# EAGLE schematic FA_IOTv4.2.1 (EAGLE 7.2.0)

## Sheet 1 of 6
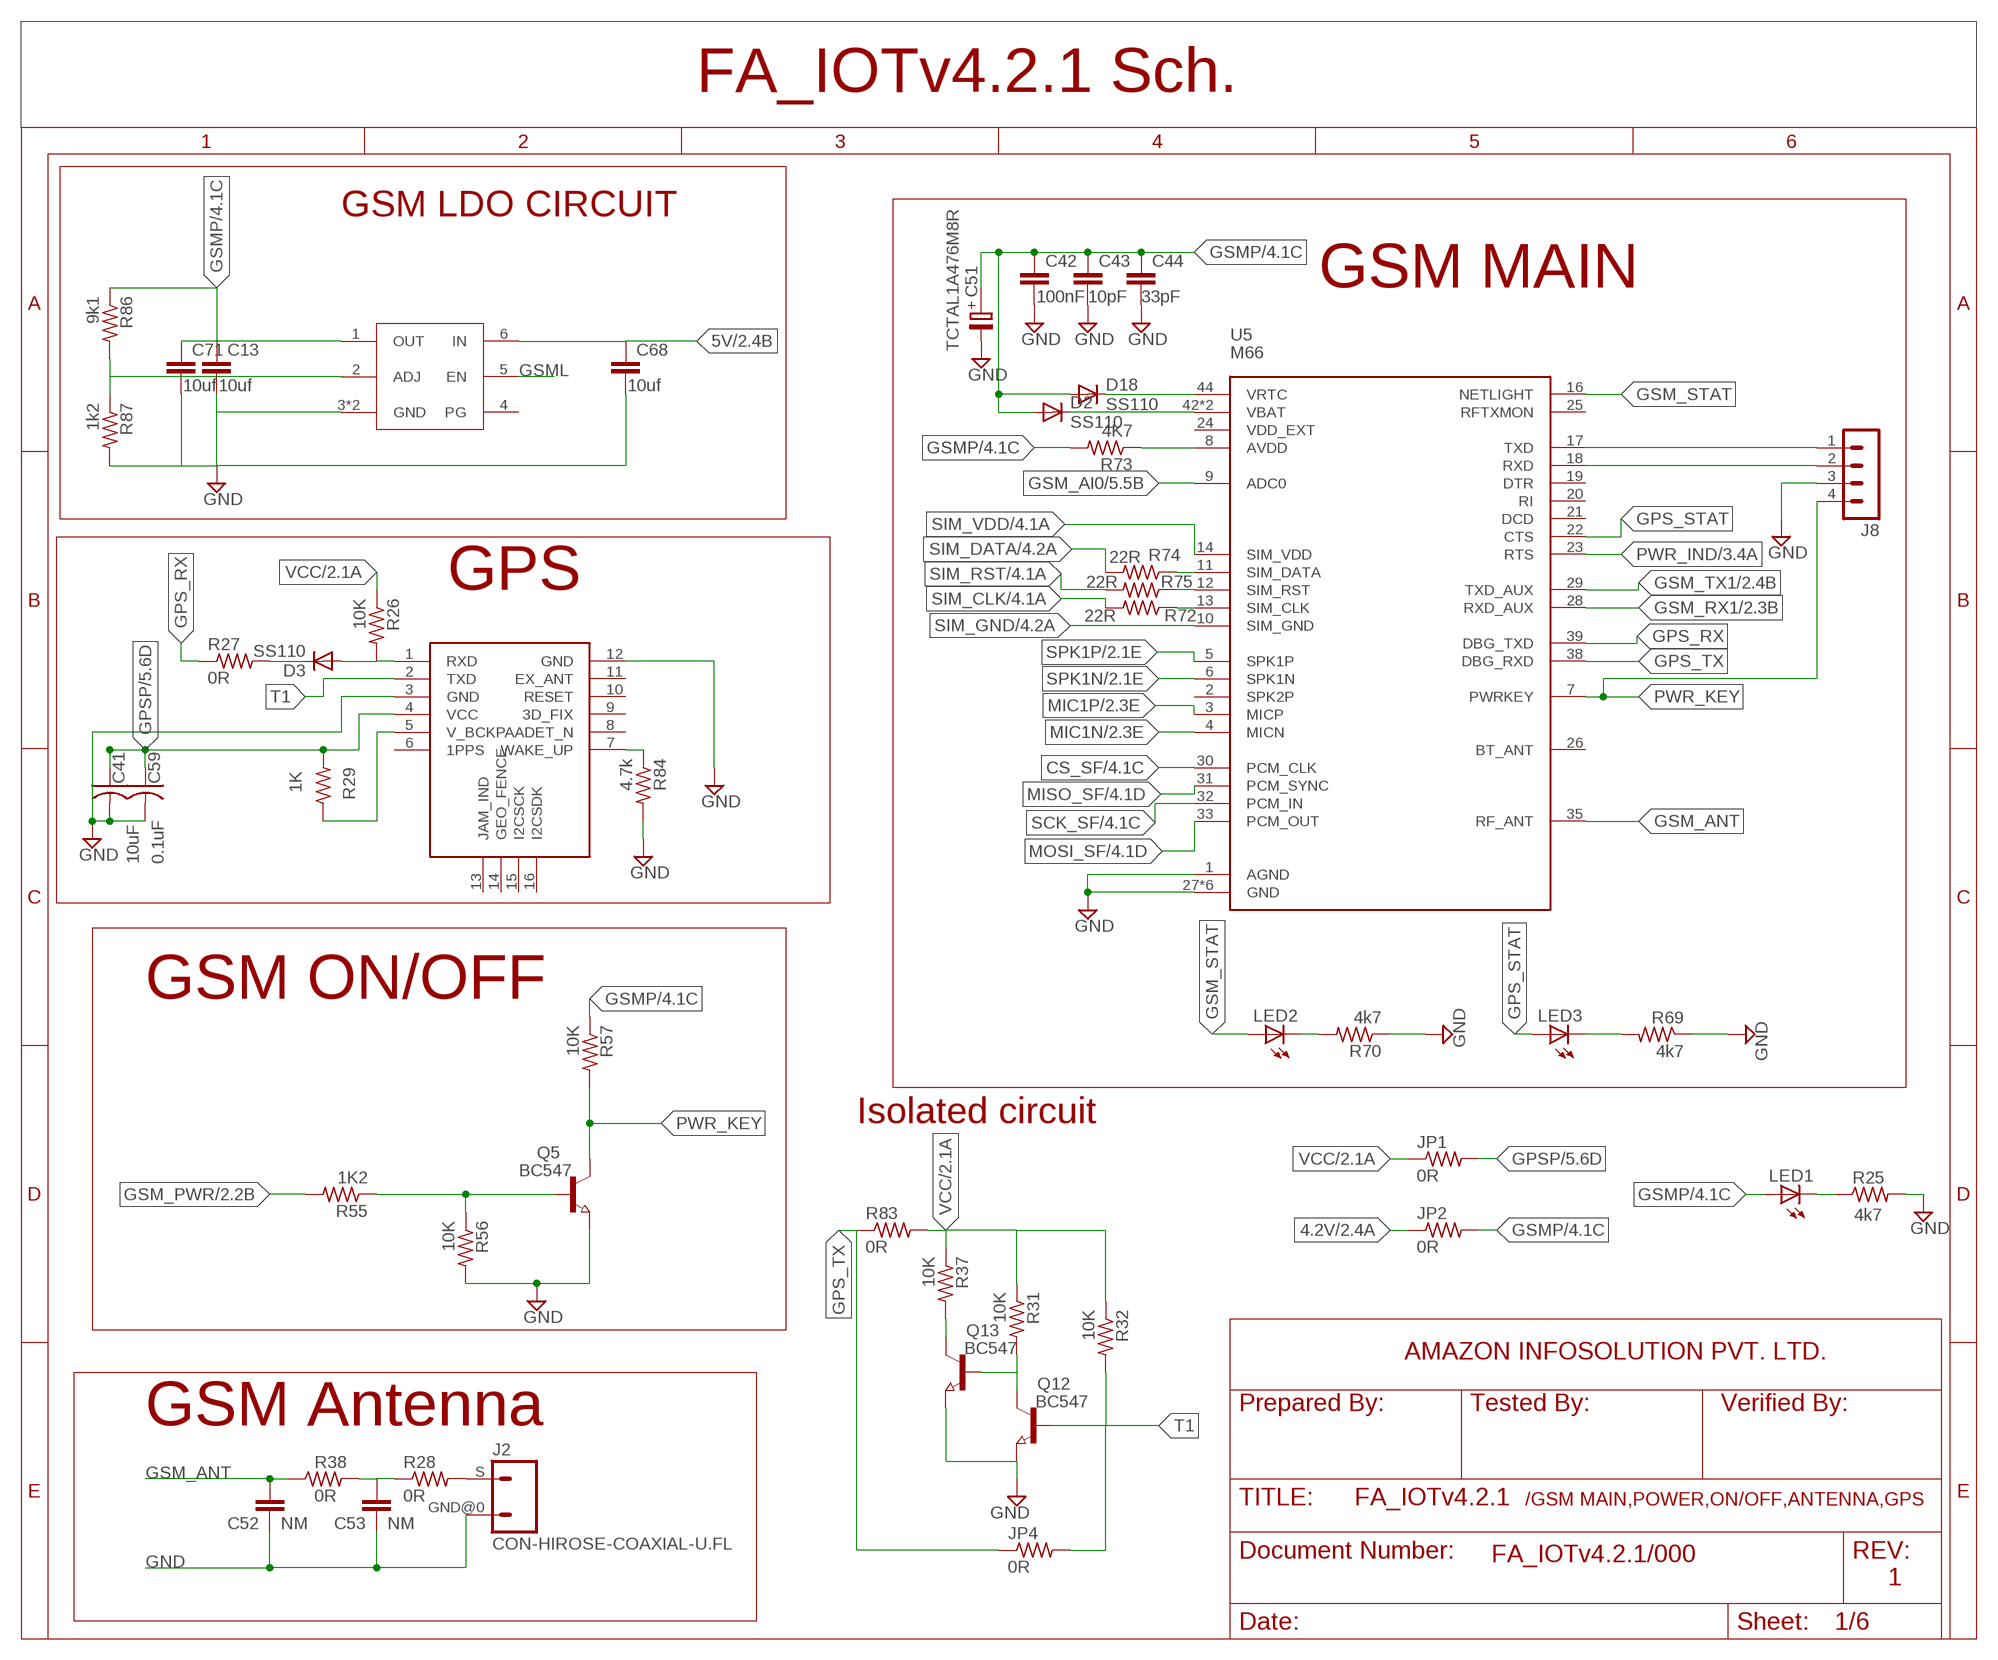
[diagram p0: schematic, sheet 1]

### Parts
C13  10uf  C-EUC0805  [C0805]
C41  10uF  C-USC0805  [C0805]
C42  100nF  C-EUC0805  [C0805]
C43  10pF  C-EUC0805  [C0805]
C44  33pF  C-EUC0805  [C0805]
C51  TCTAL1A476M8R  C-PR-SMD-TE-A  [TE-A-3216]
C52  NM  C-EUC0402  [C0402]
C53  NM  C-EUC0402  [C0402]
C59  0.1uF  C-USC0402  [C0402]
C68  10uf  C-EUC0805  [C0805]
C71  10uf  C-EUC0805  [C0805]
D2  SS110  S1M  [DO-214AC]
D3  SS110  S1M  [DO-214AC]
D18  SS110  S1M  [DO-214AC]
J2  CON-HIROSE-COAXIAL-U.FL  [CON-U.FL]
J8  MA04-1  [MA04-1]
JP1  0R  R-US_R0805  [R0805]
JP2  0R  R-US_R0805  [R0805]
JP4  0R  R-US_R0805  [R0805]
LED1  LEDCHIP-LED0805  [CHIP-LED0805]
LED2  LEDCHIP-LED0805  [CHIP-LED0805]
LED3  LEDCHIP-LED0805  [CHIP-LED0805]
Q5  BC547  NPN-TRANSISTOR_SOT23  [SOT23]
Q12  BC547  NPN-TRANSISTOR_SOT23  [SOT23]
Q13  BC547  NPN-TRANSISTOR_SOT23  [SOT23]
R25  4k7  R-US_R0402  [R0402]
R26  10K  R-US_R0402  [R0402]
R27  0R  R-US_R0805  [R0805]
R28  0R  R-US_R0402  [R0402]
R29  1K  R-US_R0402  [R0402]
R31  10K  R-US_R0402  [R0402]
R32  10K  R-US_R0402  [R0402]
R37  10K  R-US_R0402  [R0402]
R38  0R  R-US_R0402  [R0402]
R55  1K2  R-US_R0402  [R0402]
R56  10K  R-US_R0402  [R0402]
R57  10K  R-US_R0402  [R0402]
R69  4k7  R-US_R0402  [R0402]
R70  4k7  R-US_R0402  [R0402]
R72  22R  R-US_R0402  [R0402]
R73  4K7  R-US_R0402  [R0402]
R74  22R  R-US_R0402  [R0402]
R75  22R  R-US_R0402  [R0402]
R83  0R  R-US_R0805  [R0805]
R84  4.7k  R-US_R0402  [R0402]
R86  9k1  R-US_R0402  [R0402]
R87  1k2  R-US_R0402  [R0402]
U5  M66  [M66]
U$1  L89  [L89]
U$3  LD39200PU33R  [SON95P300X300X100-7N]

### Nets
4.2V [POWER]: JP2.1 ; also sheet 2,3,5
5V: C68.1 U$3.6(IN) ; also sheet 2,4,5,6
CS_SF: U5.30(PCM_CLK) ; also sheet 4
GND: C13.2 C41.2 C42.2 C43.2 C44.2 C51.- C52.2 C53.2 C59.2 C68.2 C71.2 J2.GND@0 J8.3 Q5.2(E) Q12.2(E) Q13.2(E) R25.2 R56.2 R69.1 R70.1 R84.2 R87.2 U5.1(AGND) U5.27(GND) U5.34(GND) U5.36(GND) U5.37(GND) U5.40(GND) U5.41(GND) U$1.3(GND) U$1.12(GND) U$3.3(GND) U$3.7(GND) ; also sheet 2,3,4,5,6
GPS_RX: R27.1 U5.39(DBG_TXD)
GPS_STAT: LED3.A U5.22(CTS)
GPS_TX: JP4.1 R83.1 U5.38(DBG_RXD)
GPSP: C41.1 C59.1 JP1.2 R29.2 U$1.4(VCC) ; also sheet 5
GSM_AI0: U5.9(ADC0) ; also sheet 5
GSM_ANT: C52.1 R38.1 U5.35(RF_ANT)
GSM_PWR: R55.2 ; also sheet 2
GSM_RX1: U5.28(RXD_AUX) ; also sheet 2
GSM_STAT: LED2.A U5.16(NETLIGHT)
GSM_TX1: U5.29(TXD_AUX) ; also sheet 2
GSML: U$3.5(EN) ; also sheet 2
GSMP: C13.1 C42.1 C43.1 C44.1 C51.+ C71.1 D2.A D18.A JP2.2 LED1.A R57.1 R73.2 R86.1 U$3.1(OUT) ; also sheet 4
MIC1N: U5.4(MICN) ; also sheet 2,6
MIC1P: U5.3(MICP) ; also sheet 2,6
MISO_SF: U5.31(PCM_SYNC) ; also sheet 4
MOSI_SF: U5.33(PCM_OUT) ; also sheet 4
N$12: Q13.3(C) R37.2
N$14: D2.C U5.42(VBAT) U5.43(VBAT)
N$18: J2.S R28.2
N$31: R29.1 U$1.5(V_BCKP)
N$32: D3.A R26.2 U$1.1(RXD)
N$36: D3.C R27.2
N$39: Q12.3(C) Q13.1(B) R31.2
N$40: Q5.1(B) R55.1 R56.1
N$46: R84.1 U$1.7(WAKE_UP)
N$52: LED1.C R25.1
N$55: LED3.C R69.2
N$56: LED2.C R70.2
N$57: R73.1 U5.8(AVDD)
N$58: R74.1 U5.11(SIM_DATA)
N$59: D18.C U5.44(VRTC)
N$60: R75.1 U5.12(SIM_RST)
N$61: R72.1 U5.13(SIM_CLK)
N$67: R86.2 R87.1 U$3.2(ADJ)
PWR_IND: U5.23(RTS) ; also sheet 3
PWR_KEY: J8.4 Q5.3(C) R57.2 U5.7(PWRKEY)
RF_ANT: C53.1 R28.1 R38.2
RX_DEBUG: J8.2 U5.18(RXD)
SCK_SF: U5.32(PCM_IN) ; also sheet 4
SIM_CLK: R72.2 ; also sheet 4
SIM_DATA: R74.2 ; also sheet 4
SIM_GND: U5.10(SIM_GND) ; also sheet 4
SIM_RST: R75.2 ; also sheet 4
SIM_VDD: U5.14(SIM_VDD) ; also sheet 4
SPK1N: U5.6(SPK1N) ; also sheet 2,6
SPK1P: U5.5(SPK1P) ; also sheet 2,6
T1: JP4.2 Q12.1(B) R32.2 U$1.2(TXD)
TX_DEBUG: J8.1 U5.17(TXD)
VCC: JP1.1 R26.1 R31.1 R32.1 R37.1 R83.2 ; also sheet 2,3,4,6
Unconnected: U5.2(SPK2P) U5.19(DTR) U5.20(RI) U5.21(DCD) U5.24(VDD_EXT) U5.25(RFTXMON) U5.26(BT_ANT) U$1.6(1PPS) U$1.8(AADET_N) U$1.9(3D_FIX) U$1.10(RESET) U$1.11(EX_ANT) U$1.13(JAM_IND) U$1.14(GEO_FENCE) U$1.15(I2CSCK) U$1.16(I2CSDK) U$3.4(PG)

### Notes on the sheet
- FA_IOTv4.2.1 Sch.
- GSM LDO CIRCUIT
- GSM MAIN
- GPS
- GSM ON/OFF
- Isolated circuit
- AMAZON INFOSOLUTION PVT. LTD.
- Prepared By: | Tested By: | Verified By:
- GSM Antenna
- /GSM MAIN,POWER,ON/OFF,ANTENNA,GPS
- FA_IOTv4.2.1/000
- 1

## Sheet 2 of 6
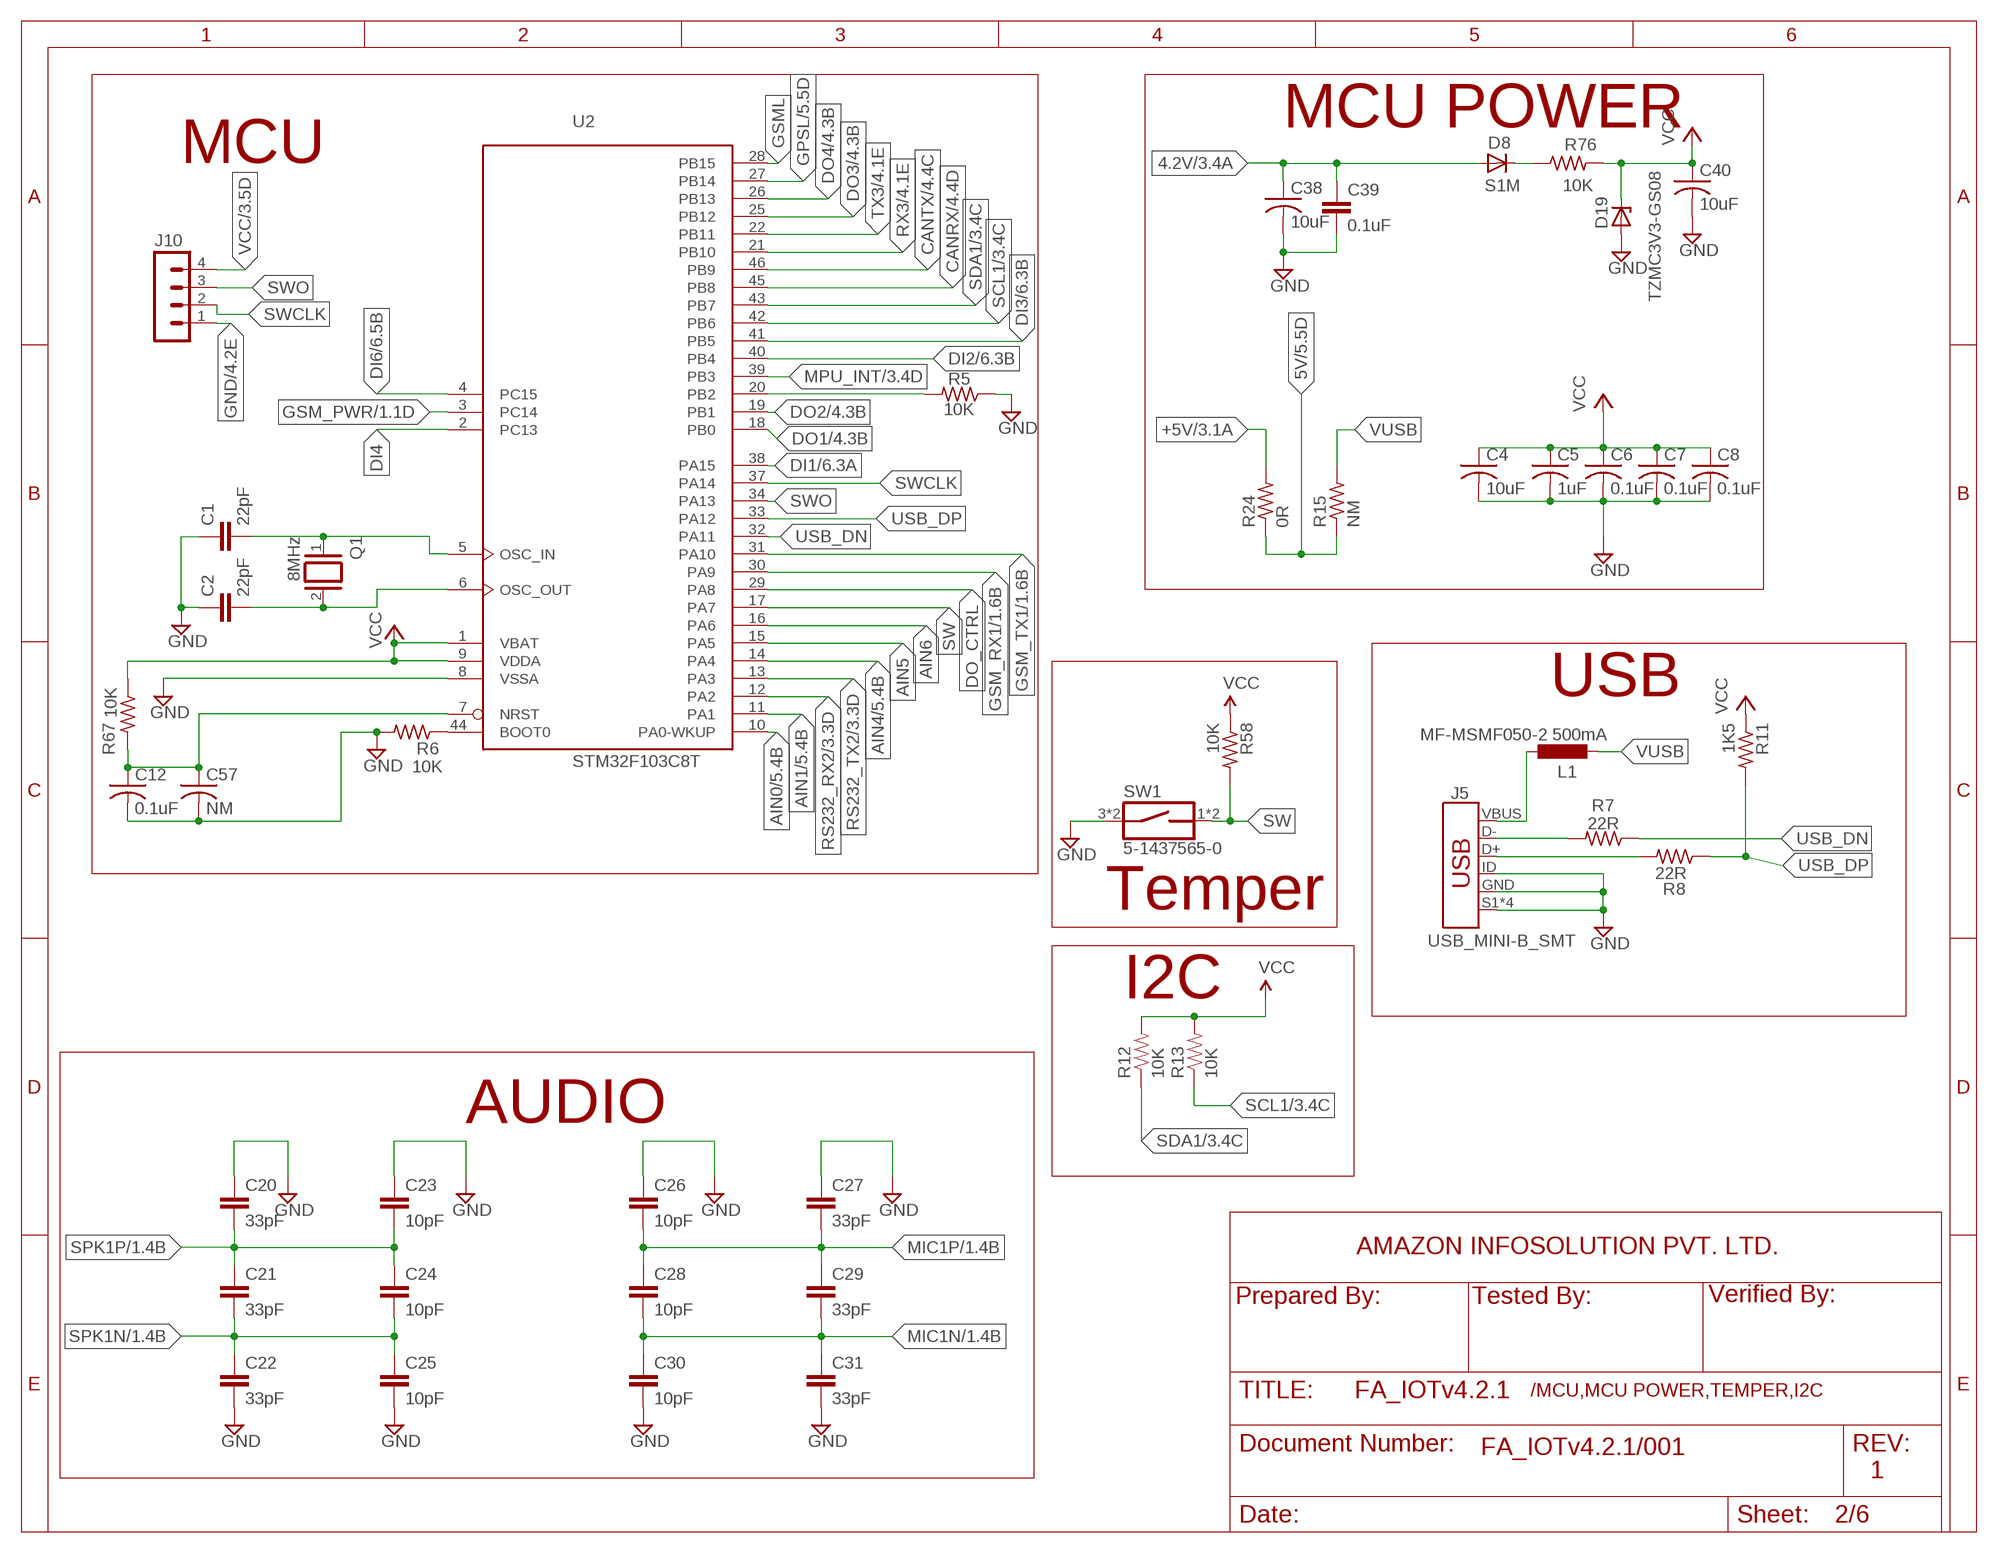
[diagram p1: schematic, sheet 2]

### Parts
C1  22pF  C-EUC0201  [C0201]
C2  22pF  C-EUC0201  [C0201]
C4  10uF  C-USC0805  [C0805]
C5  1uF  C-USC0603  [C0603]
C6  0.1uF  C-USC0402  [C0402]
C7  0.1uF  C-USC0402  [C0402]
C8  0.1uF  C-USC0402  [C0402]
C12  0.1uF  C-USC0402  [C0402]
C20  33pF  C-EUC0402  [C0402]
C21  33pF  C-EUC0402  [C0402]
C22  33pF  C-EUC0402  [C0402]
C23  10pF  C-EUC0402  [C0402]
C24  10pF  C-EUC0402  [C0402]
C25  10pF  C-EUC0402  [C0402]
C26  10pF  C-EUC0402  [C0402]
C27  33pF  C-EUC0402  [C0402]
C28  10pF  C-EUC0402  [C0402]
C29  33pF  C-EUC0402  [C0402]
C30  10pF  C-EUC0402  [C0402]
C31  33pF  C-EUC0402  [C0402]
C38  10uF  C-USC0805  [C0805]
C39  0.1uF  C-EUC0805  [C0805]
C40  10uF  C-USC0805  [C0805]
C57  NM  C-USC0402  [C0402]
D8  S1M  [DO-214AC]
D19  TZMC3V3-GS08  ZENER-DIODESOD80C  [SOD80C]
J5  USB_MINI-B_SMT  [USB-MINIB]
J10  MA04-1  [MA04-1]
L1  MF-MSMF050-2 500mA  L-EUL1812  [L1812]
Q1  8MHz  XTAL/S  [QS]
R5  10K  R-US_R0402  [R0402]
R6  10K  R-US_R0402  [R0402]
R7  22R  R-US_R0402  [R0402]
R8  22R  R-US_R0402  [R0402]
R11  1K5  R-US_R0402  [R0402]
R12  10K  RESISTOR0603-RES  [0603-RES]
R13  10K  RESISTOR0603-RES  [0603-RES]
R15  NM  R-US_R0805  [R0805]
R24  0R  R-US_R0805  [R0805]
R58  10K  R-US_R0402  [R0402]
R67  10K  R-US_R0402  [R0402]
R76  10K  R-US_R0805  [R0805]
SW1  5-1437565-0  [SW_5-1437565-0]
U2  STM32F103C8T  [LQFP48]

### Nets
4.2V [POWER]: C38.1 C39.1 D8.A ; also sheet 1,3,5
5V: R15.1 R24.1 ; also sheet 1,4,5,6
+5V: R24.2 ; also sheet 3
AIN0: U2.10(PA0-WKUP) ; also sheet 5
AIN1: U2.11(PA1) ; also sheet 5
AIN4: U2.14(PA4) ; also sheet 5
AIN5: U2.15(PA5)
AIN6: U2.16(PA6)
CANRX: U2.45(PB8) ; also sheet 4
CANTX: U2.46(PB9) ; also sheet 4
DI1: U2.38(PA15) ; also sheet 6
DI2: U2.40(PB4) ; also sheet 6
DI3: U2.41(PB5) ; also sheet 6
DI4: U2.2(PC13)
DI6: U2.4(PC15) ; also sheet 6
DO1: U2.18(PB0) ; also sheet 4
DO2: U2.19(PB1) ; also sheet 4
DO3: U2.25(PB12) ; also sheet 4
DO4: U2.26(PB13) ; also sheet 4
DO_CTRL: U2.29(PA8)
GND: C1.1 C2.1 C4.2 C5.2 C6.2 C7.2 C8.2 C12.2 C20.1 C22.2 C23.1 C25.2 C26.1 C27.1 C30.2 C31.2 C38.2 C39.2 C40.2 C57.2 D19.A J5.GND J5.ID J5.S1(SHIELD) J5.S2(SHIELD) J5.S3(SHIELD) J5.S4(SHIELD) J10.1 R5.1 R6.2 SW1.3 SW1.4 U2.8(VSSA) ; also sheet 1,3,4,5,6
GPSL: U2.27(PB14) ; also sheet 5
GSM_PWR: U2.3(PC14) ; also sheet 1
GSM_RX1: U2.30(PA9) ; also sheet 1
GSM_TX1: U2.31(PA10) ; also sheet 1
GSML: U2.28(PB15) ; also sheet 1
MIC1N: C28.2 C29.2 C30.1 C31.1 ; also sheet 1,6
MIC1P: C26.2 C27.2 C28.1 C29.1 ; also sheet 1,6
MPU_INT: U2.39(PB3) ; also sheet 3
N$1: C1.2 Q1.1 U2.5(OSC_IN)
N$2: C2.2 Q1.2 U2.6(OSC_OUT)
N$5: R6.1 U2.44(BOOT0)
N$6: R5.2 U2.20(PB2)
N$7: J5.D- R7.2
N$9: J5.D+ R8.2
N$11: J5.VBUS L1.1
N$37: D8.C R76.1
N$38: C12.1 C57.1 R67.2 U2.7(NRST)
RS232_RX2: U2.12(PA2) ; also sheet 3
RS232_TX2: U2.13(PA3) ; also sheet 3
RX3: U2.21(PB10) ; also sheet 4
SCL1: R13.1 U2.42(PB6) ; also sheet 3,6
SDA1: R12.1 U2.43(PB7) ; also sheet 3,6
SPK1N: C21.2 C22.1 C24.2 C25.1 ; also sheet 1,6
SPK1P: C20.2 C21.1 C23.2 C24.1 ; also sheet 1,6
SW: R58.2 SW1.1 SW1.2 U2.17(PA7)
SWCLK: J10.2 U2.37(PA14)
SWO: J10.3 U2.34(PA13)
TX3: U2.22(PB11) ; also sheet 4
USB_DN: R7.1 U2.32(PA11)
USB_DP: R8.1 R11.2 U2.33(PA12)
VCC: C4.1 C5.1 C6.1 C7.1 C8.1 C40.1 D19.C J10.4 R11.1 R12.2 R13.2 R58.1 R67.1 R76.2 U2.1(VBAT) U2.9(VDDA) ; also sheet 1,3,4,6
VUSB: L1.2 R15.2

### Notes on the sheet
- MCU POWER
- MCU
- USB
- Temper
- I2C
- AUDIO
- AMAZON INFOSOLUTION PVT. LTD.
- Prepared By: | Tested By: | Verified By:
- /MCU,MCU POWER,TEMPER,I2C
- FA_IOTv4.2.1/001
- 1

## Sheet 3 of 6
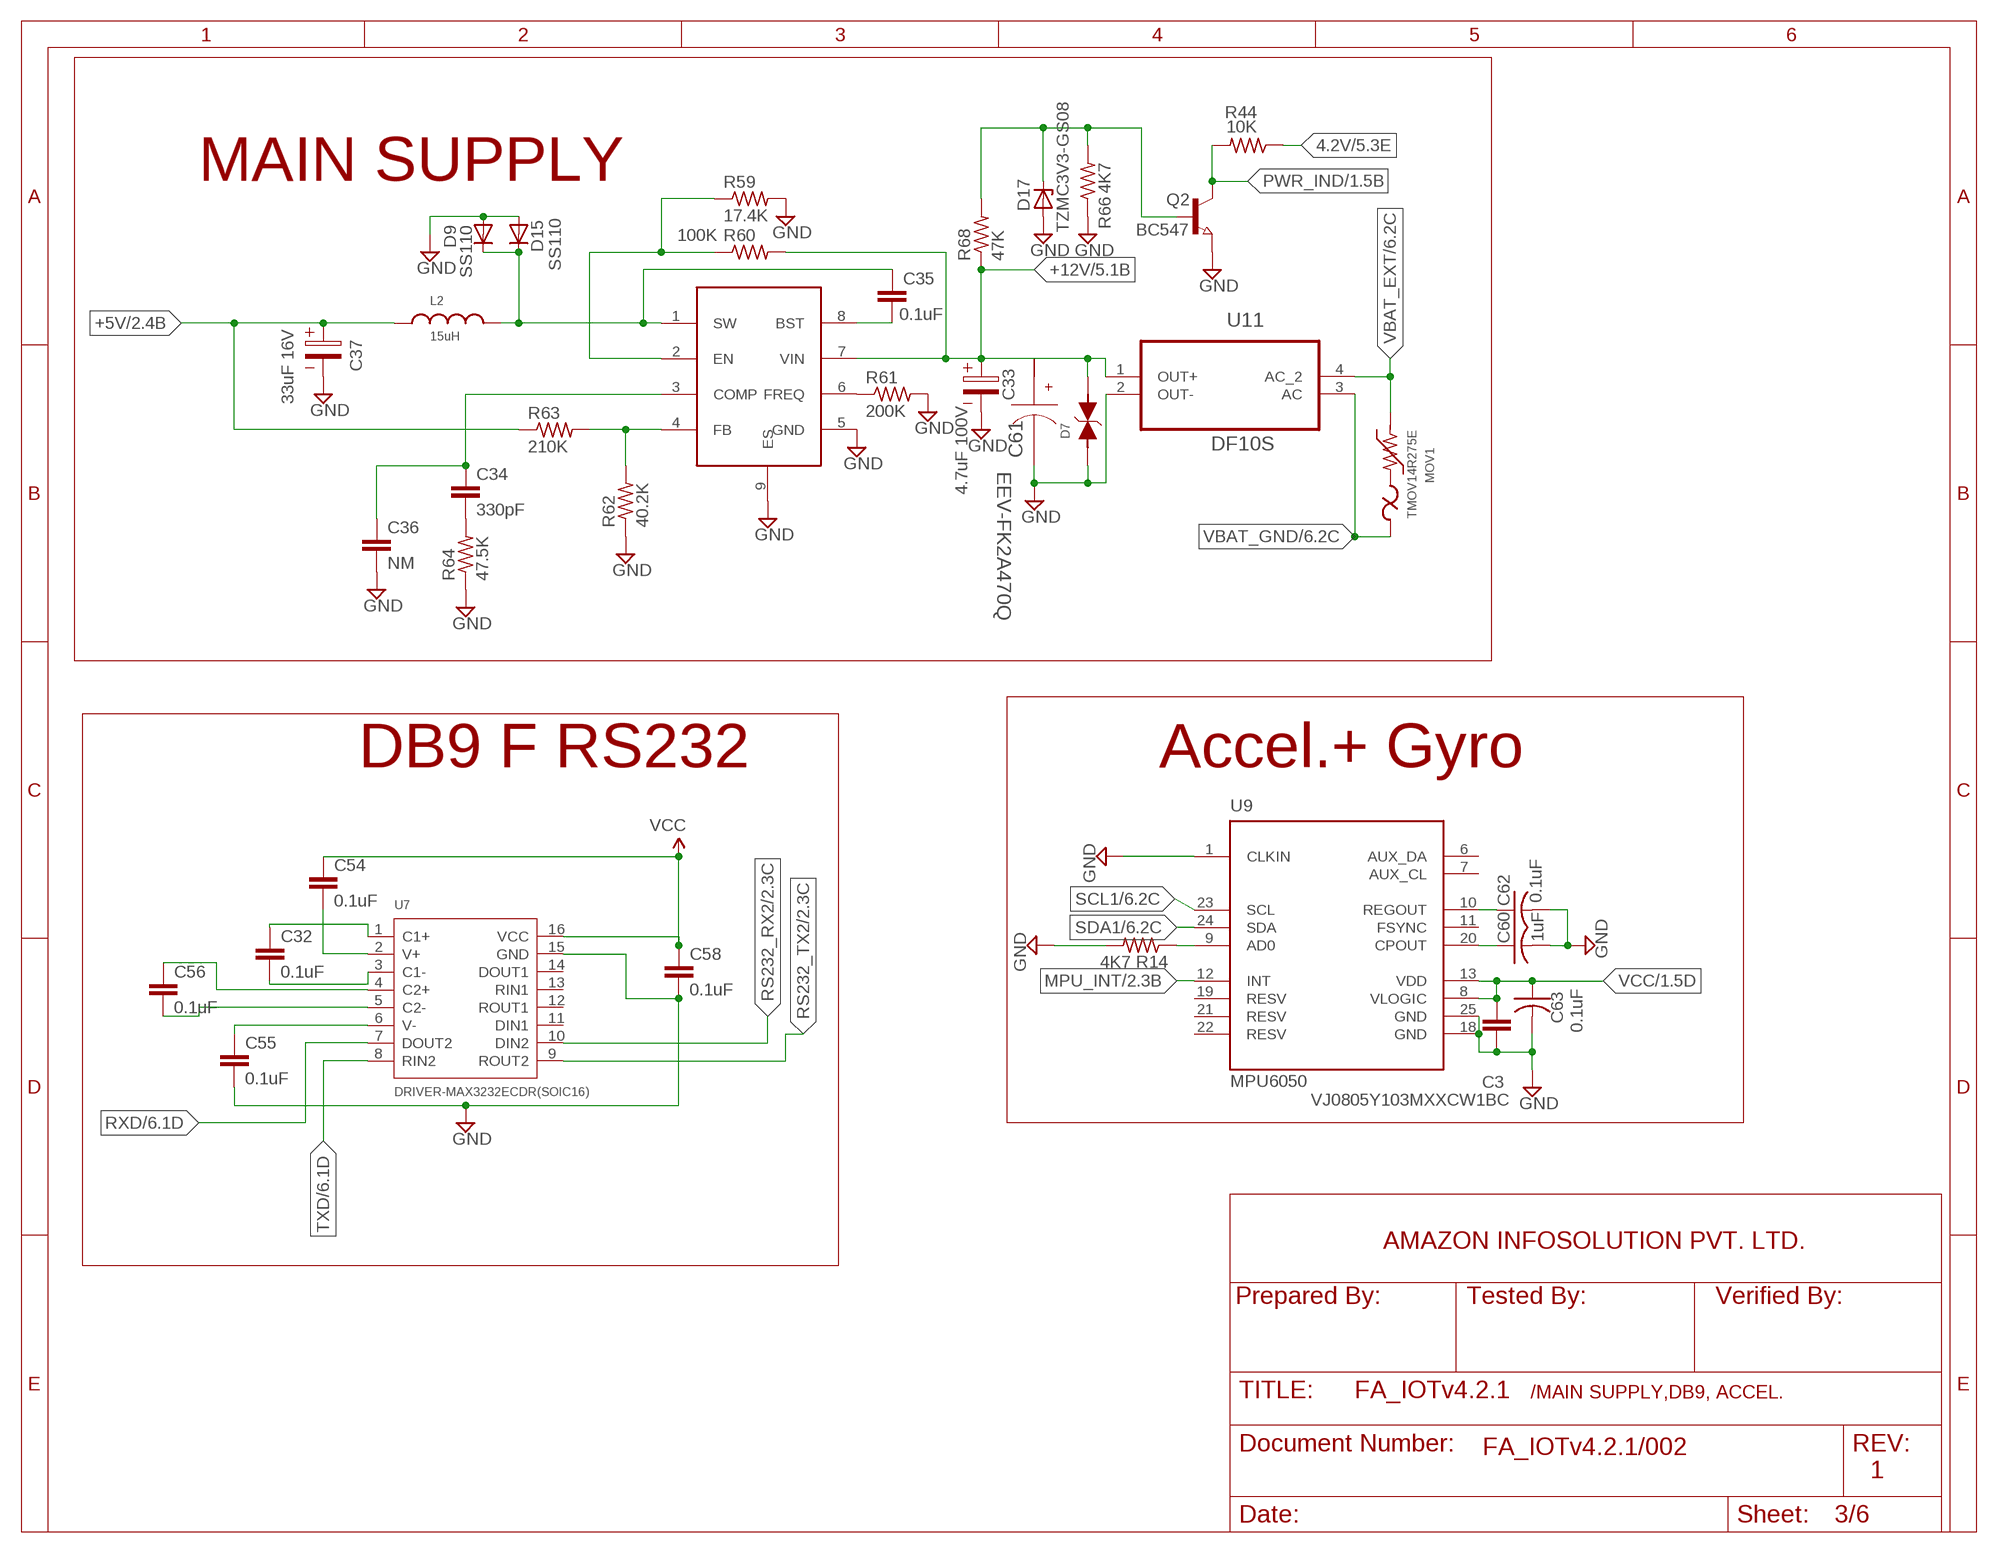
[diagram p2: schematic, sheet 3]

### Parts
C3  VJ0805Y103MXXCW1BC  C-EUC0805  [C0805]
C32  0.1uF  C-EUC0402  [C0402]
C33  4.7uF 100V  WCAP-PSLP_6,3X7,7_875105945001  [3.5X1.6X2.1(BXCXA)]
C34  330pF  C-EUC0805  [C0805]
C35  0.1uF  C-EUC0805  [C0805]
C36  NM  C-EUC0805  [C0805]
C37  33uF 16V  WCAP-ASLI_6,3X5,5_865080343005  [3.5X1.6X2.1(BXCXA)]
C54  0.1uF  C-EUC0402  [C0402]
C55  0.1uF  C-EUC0402  [C0402]
C56  0.1uF  C-EUC0402  [C0402]
C58  0.1uF  C-EUC0402  [C0402]
C60  1uF  C-USC0603  [C0603]
C61  EEV-FK2A470Q  [SM_RADIAL_H13]
C62  0.1uF  C-USC0402  [C0402]
C63  0.1uF  C-USC0402  [C0402]
D7  WE-TVSP_BI_1500W_824541331  [VARTVSP_SMC&SMD/DO-214AB]
D9  SS110  S1M  [DO-214AC]
D15  SS110  S1M  [DO-214AC]
D17  TZMC3V3-GS08  ZENER-DIODESOD80C  [SOD80C]
L2  15uH  WE-PD_1260_744771115  [WE-PD_1260/1245/1280/1210]
MOV1  TMOV14R275E  [TMOV14R275E]
Q2  BC547  NPN-TRANSISTOR_SOT23  [SOT23]
R14  4K7  R-US_R0402  [R0402]
R44  10K  R-US_R0805  [R0805]
R59  17.4K  R-US_R0805  [R0805]
R60  100K  R-US_R0805  [R0805]
R61  200K  R-US_R0805  [R0805]
R62  40.2K  R-US_R0805  [R0805]
R63  210K  R-US_R0805  [R0805]
R64  47.5K  R-US_R0805  [R0805]
R66  4K7  R-US_R0805  [R0805]
R68  47K  R-US_R0805  [R0805]
U7  DRIVER-MAX3232ECDR(SOIC16)  [SOIC16-1.27-10X3.9MM]
U9  MPU6050  [QFN50P400X400X95-25T265X275N]
U10  MP4559DN  [SOIC127P600X170-9N]
U11  DF10S  [SOT508P985X260-4N]

### Nets
4.2V [POWER]: R44.1 ; also sheet 1,2,5
+5V: C37.1 L2.1 R63.1 ; also sheet 2
+12V [POWER]: C33.1 C61.1(+) D7.2 R60.2 R68.1 U10.7(VIN) U11.1(OUT+) ; also sheet 4,5
GND: C3.2 C33.2 C36.2 C37.2 C55.2 C58.2 C60.2 C61.2(-) C62.2 C63.2 D7.1 D9.A D15.A D17.A Q2.2(E) R14.2 R59.2 R61.2 R62.1 R64.1 R66.1 U7.15(GND) U9.1(CLKIN) U9.18(GND) U9.25(GND) U10.5(GND) U10.9(ES) U11.2(OUT-) ; also sheet 1,2,4,5,6
MPU_INT: U9.12(INT) ; also sheet 2
N$17: C35.1 D9.C D15.C L2.2 U10.1(SW)
N$23: R14.1 U9.9(AD0)
N$24: C62.1 U9.10(REGOUT)
N$29: C32.1 U7.1(C1+)
N$30: C32.2 U7.3(C1-)
N$33: C60.1 U9.20(CPOUT)
N$41: R59.1 R60.1 U10.2(EN)
N$42: C34.2 R64.2
N$43: R61.1 U10.6(FREQ)
N$44: R62.2 R63.2 U10.4(FB)
N$49: C34.1 C36.1 U10.3(COMP)
N$51: C35.2 U10.8(BST)
N$62: D17.C Q2.1(B) R66.2 R68.2
N$63: C54.2 U7.2(V+)
N$69: C56.1 U7.4(C2+)
N$70: C56.2 U7.5(C2-)
N$71: C55.1 U7.6(V-)
PWR_IND: Q2.3(C) R44.2 ; also sheet 1
RS232_RX2: U7.10(DIN2) ; also sheet 2
RS232_TX2: U7.9(ROUT2) ; also sheet 2
RXD: U7.7(DOUT2) ; also sheet 6
SCL1: U9.23(SCL) ; also sheet 2,6
SDA1: U9.24(SDA) ; also sheet 2,6
TXD: U7.8(RIN2) ; also sheet 6
VBAT_EXT: MOV1.2(MOV) U11.4(AC_2) ; also sheet 6
VBAT_GND: MOV1.1(FUSE) U11.3(AC) ; also sheet 6
VCC: C3.1 C54.1 C58.1 C63.1 U7.16(VCC) U9.8(VLOGIC) U9.13(VDD) ; also sheet 1,2,4,6
Unconnected: U7.11(DIN1) U7.12(ROUT1) U7.13(RIN1) U7.14(DOUT1) U9.2(NC) U9.3(NC) U9.4(NC) U9.5(NC) U9.6(AUX_DA) U9.7(AUX_CL) U9.11(FSYNC) U9.14(NC) U9.15(NC) U9.16(NC) U9.17(NC) U9.19(RESV) U9.21(RESV) U9.22(RESV)

### Notes on the sheet
- MAIN SUPPLY
- DB9 F RS232 | Accel.+ Gyro
- AMAZON INFOSOLUTION PVT. LTD.
- Prepared By: | Tested By: | Verified By:
- /MAIN SUPPLY,DB9, ACCEL.
- FA_IOTv4.2.1/002
- 1

## Sheet 4 of 6
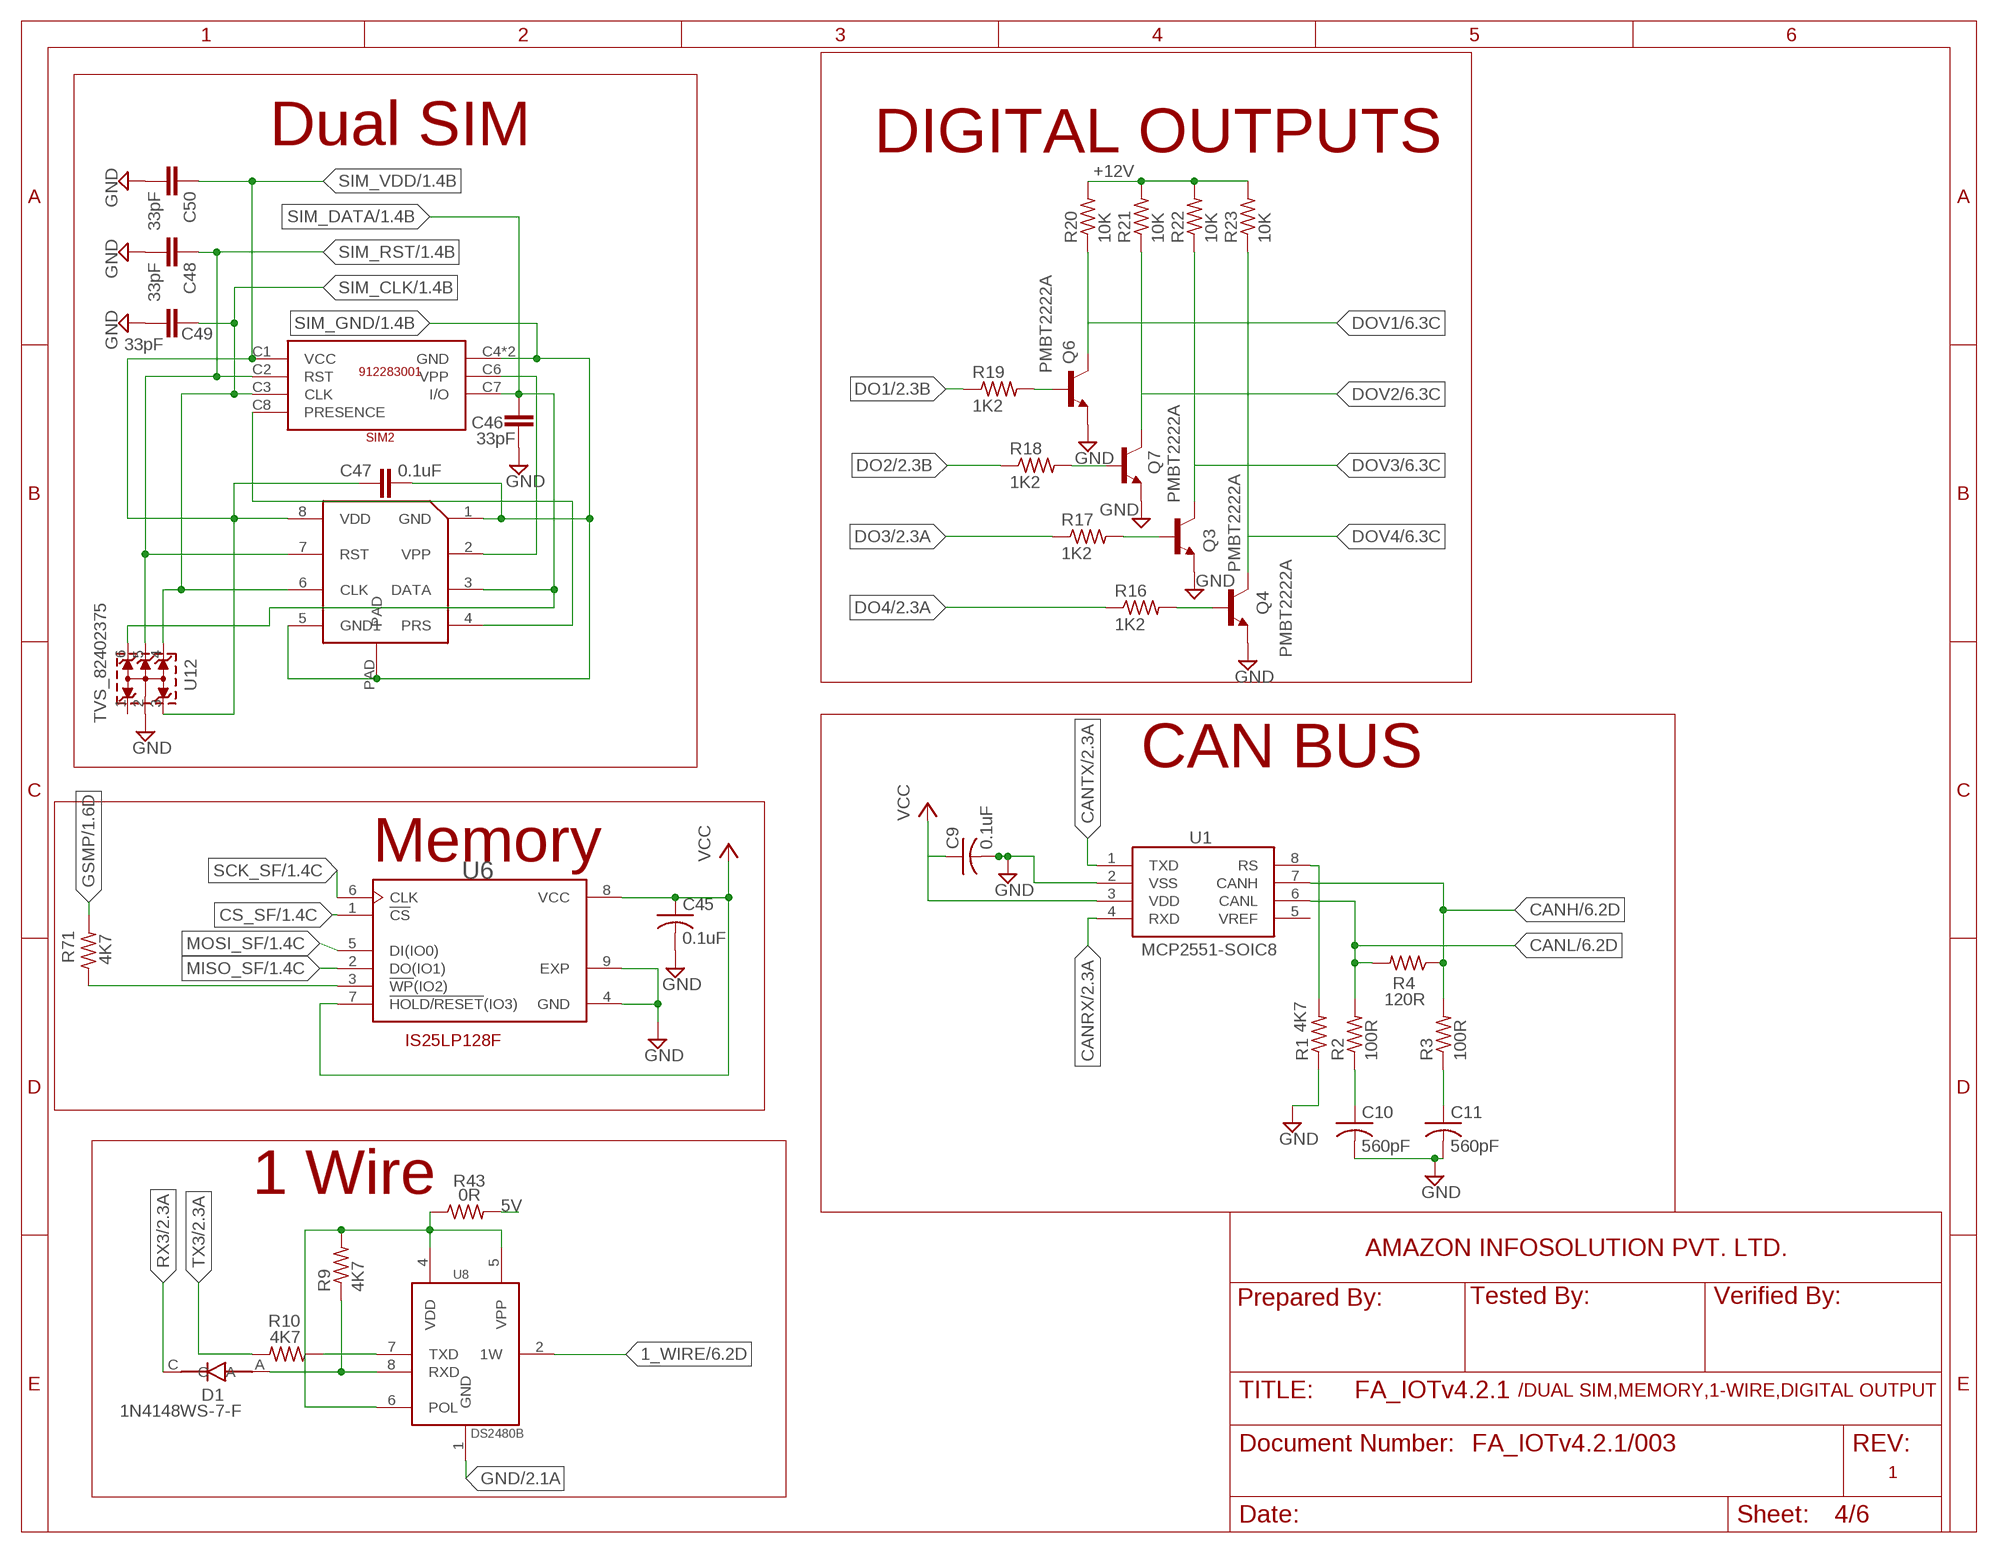
[diagram p3: schematic, sheet 4]

### Parts
C9  0.1uF  C-USC0805  [C0805]
C10  560pF  C-USC0402  [C0402]
C11  560pF  C-USC0402  [C0402]
C45  0.1uF  C-USC0402  [C0402]
C46  33pF  C-EUC0805  [C0805]
C47  0.1uF  C-EUC0805  [C0805]
C48  33pF  C-EUC0805  [C0805]
C49  33pF  C-EUC0805  [C0805]
C50  33pF  C-EUC0805  [C0805]
D1  1N4148WS-7-F  [SOD2513X120N]
Q3  PMBT2222A  [SOT23-BEC]
Q4  PMBT2222A  [SOT23-BEC]
Q6  PMBT2222A  [SOT23-BEC]
Q7  PMBT2222A  [SOT23-BEC]
R1  4K7  R-US_R0402  [R0402]
R2  100R  R-US_R0402  [R0402]
R3  100R  R-US_R0402  [R0402]
R4  120R  R-US_R0402  [R0402]
R9  4K7  R-US_R0402  [R0402]
R10  4K7  R-US_R0402  [R0402]
R16  1K2  R-US_R0402  [R0402]
R17  1K2  R-US_R0402  [R0402]
R18  1K2  R-US_R0402  [R0402]
R19  1K2  R-US_R0402  [R0402]
R20  10K  R-US_R0805  [R0805]
R21  10K  R-US_R0805  [R0805]
R22  10K  R-US_R0805  [R0805]
R23  10K  R-US_R0805  [R0805]
R43  0R  R-US_R0805  [R0805]
R71  4K7  R-US_R0402  [R0402]
SIM1  MFF2_SIM  [MFF2DFN8]
SIM2  912283001  [91228-3001]
U1  MCP2551-SOIC8  [SOIC8-6.0]
U6  W25Q32FVZPIG_TR  [SON127P600X500X80-9N]
U8  DS2480B  [SO08]
U12  TVS_82402375  WE-TVS_82402375  [WE-TVS_SC70-6L]

### Nets
1_WIRE: U8.2(1W) ; also sheet 6
5V: R43.2 ; also sheet 1,2,5,6
+12V [POWER]: R20.2 R21.2 R22.2 R23.2 ; also sheet 3,5
CANH: R3.2 R4.1 U1.7(CANH) ; also sheet 6
CANL: R2.2 R4.2 U1.6(CANL) ; also sheet 6
CANRX: U1.4(RXD) ; also sheet 2
CANTX: U1.1(TXD) ; also sheet 2
CS_SF: U6.1(!CS) ; also sheet 1
DO1: R19.1 ; also sheet 2
DO2: R18.1 ; also sheet 2
DO3: R17.1 ; also sheet 2
DO4: R16.1 ; also sheet 2
DOV1: Q6.C R20.1 ; also sheet 6
DOV2: Q7.C R21.1 ; also sheet 6
DOV3: Q3.C R22.1 ; also sheet 6
DOV4: Q4.C R23.1 ; also sheet 6
GND: C9.2 C10.2 C11.2 C45.2 C46.2 C48.2 C49.2 C50.2 Q3.E Q4.E Q6.E Q7.E R1.1 U1.2(VSS) U6.4(GND) U6.9(EXP) U8.1(GND) U12.2(GND) ; also sheet 1,2,3,5,6
GSMP: R71.2 ; also sheet 1
MISO_SF: U6.2(DO(IO1)) ; also sheet 1
MOSI_SF: U6.5(DI(IO0)) ; also sheet 1
N$3: C10.1 R2.1
N$4: C11.1 R3.1
N$8: R1.2 U1.8(RS)
N$10: R10.1 U8.7(TXD)
N$16: D1.A R9.1 U8.8(RXD)
N$19: Q6.B R19.2
N$20: Q7.B R18.2
N$21: Q3.B R17.2
N$22: Q4.B R16.2
N$34: R9.2 R43.1 U8.4(VDD) U8.5(VPP) U8.6(POL)
N$48: R71.1 U6.3(!WP!(IO2))
N$66: SIM1.4(PRS) SIM2.C8(PRESENCE)
N$68: SIM1.2(VPP) SIM2.C6(VPP)
RX3: D1.C ; also sheet 2
SCK_SF: U6.6(CLK) ; also sheet 1
SIM_CLK: C49.1 SIM1.6(CLK) SIM2.C3(CLK) U12.4 ; also sheet 1
SIM_DATA: C46.1 SIM1.3(DATA) SIM2.C7(I/O) U12.6 ; also sheet 1
SIM_GND: C47.2 SIM1.1(GND) SIM1.5(GND1) SIM1.PAD SIM2.C4(GND) SIM2.C5(GND) ; also sheet 1
SIM_RST: C48.1 SIM1.7(RST) SIM2.C2(RST) U12.5 ; also sheet 1
SIM_VDD: C47.1 C50.1 SIM1.8(VDD) SIM2.C1(VCC) U12.3 ; also sheet 1
TX3: R10.2 ; also sheet 2
VCC: C9.1 C45.1 U1.3(VDD) U6.7(!HOLD/RESET!(IO3)) U6.8(VCC) ; also sheet 1,2,3,6
Unconnected: U1.5(VREF) U12.1

### Notes on the sheet
- Dual SIM | DIGITAL OUTPUTS
- CAN BUS
- Memory
- IS25LP128F
- 1 Wire
- AMAZON INFOSOLUTION PVT. LTD.
- Prepared By: | Tested By: | Verified By:
- /DUAL SIM,MEMORY,1-WIRE,DIGITAL OUTPUT
- FA_IOTv4.2.1/003
- 1

## Sheet 5 of 6
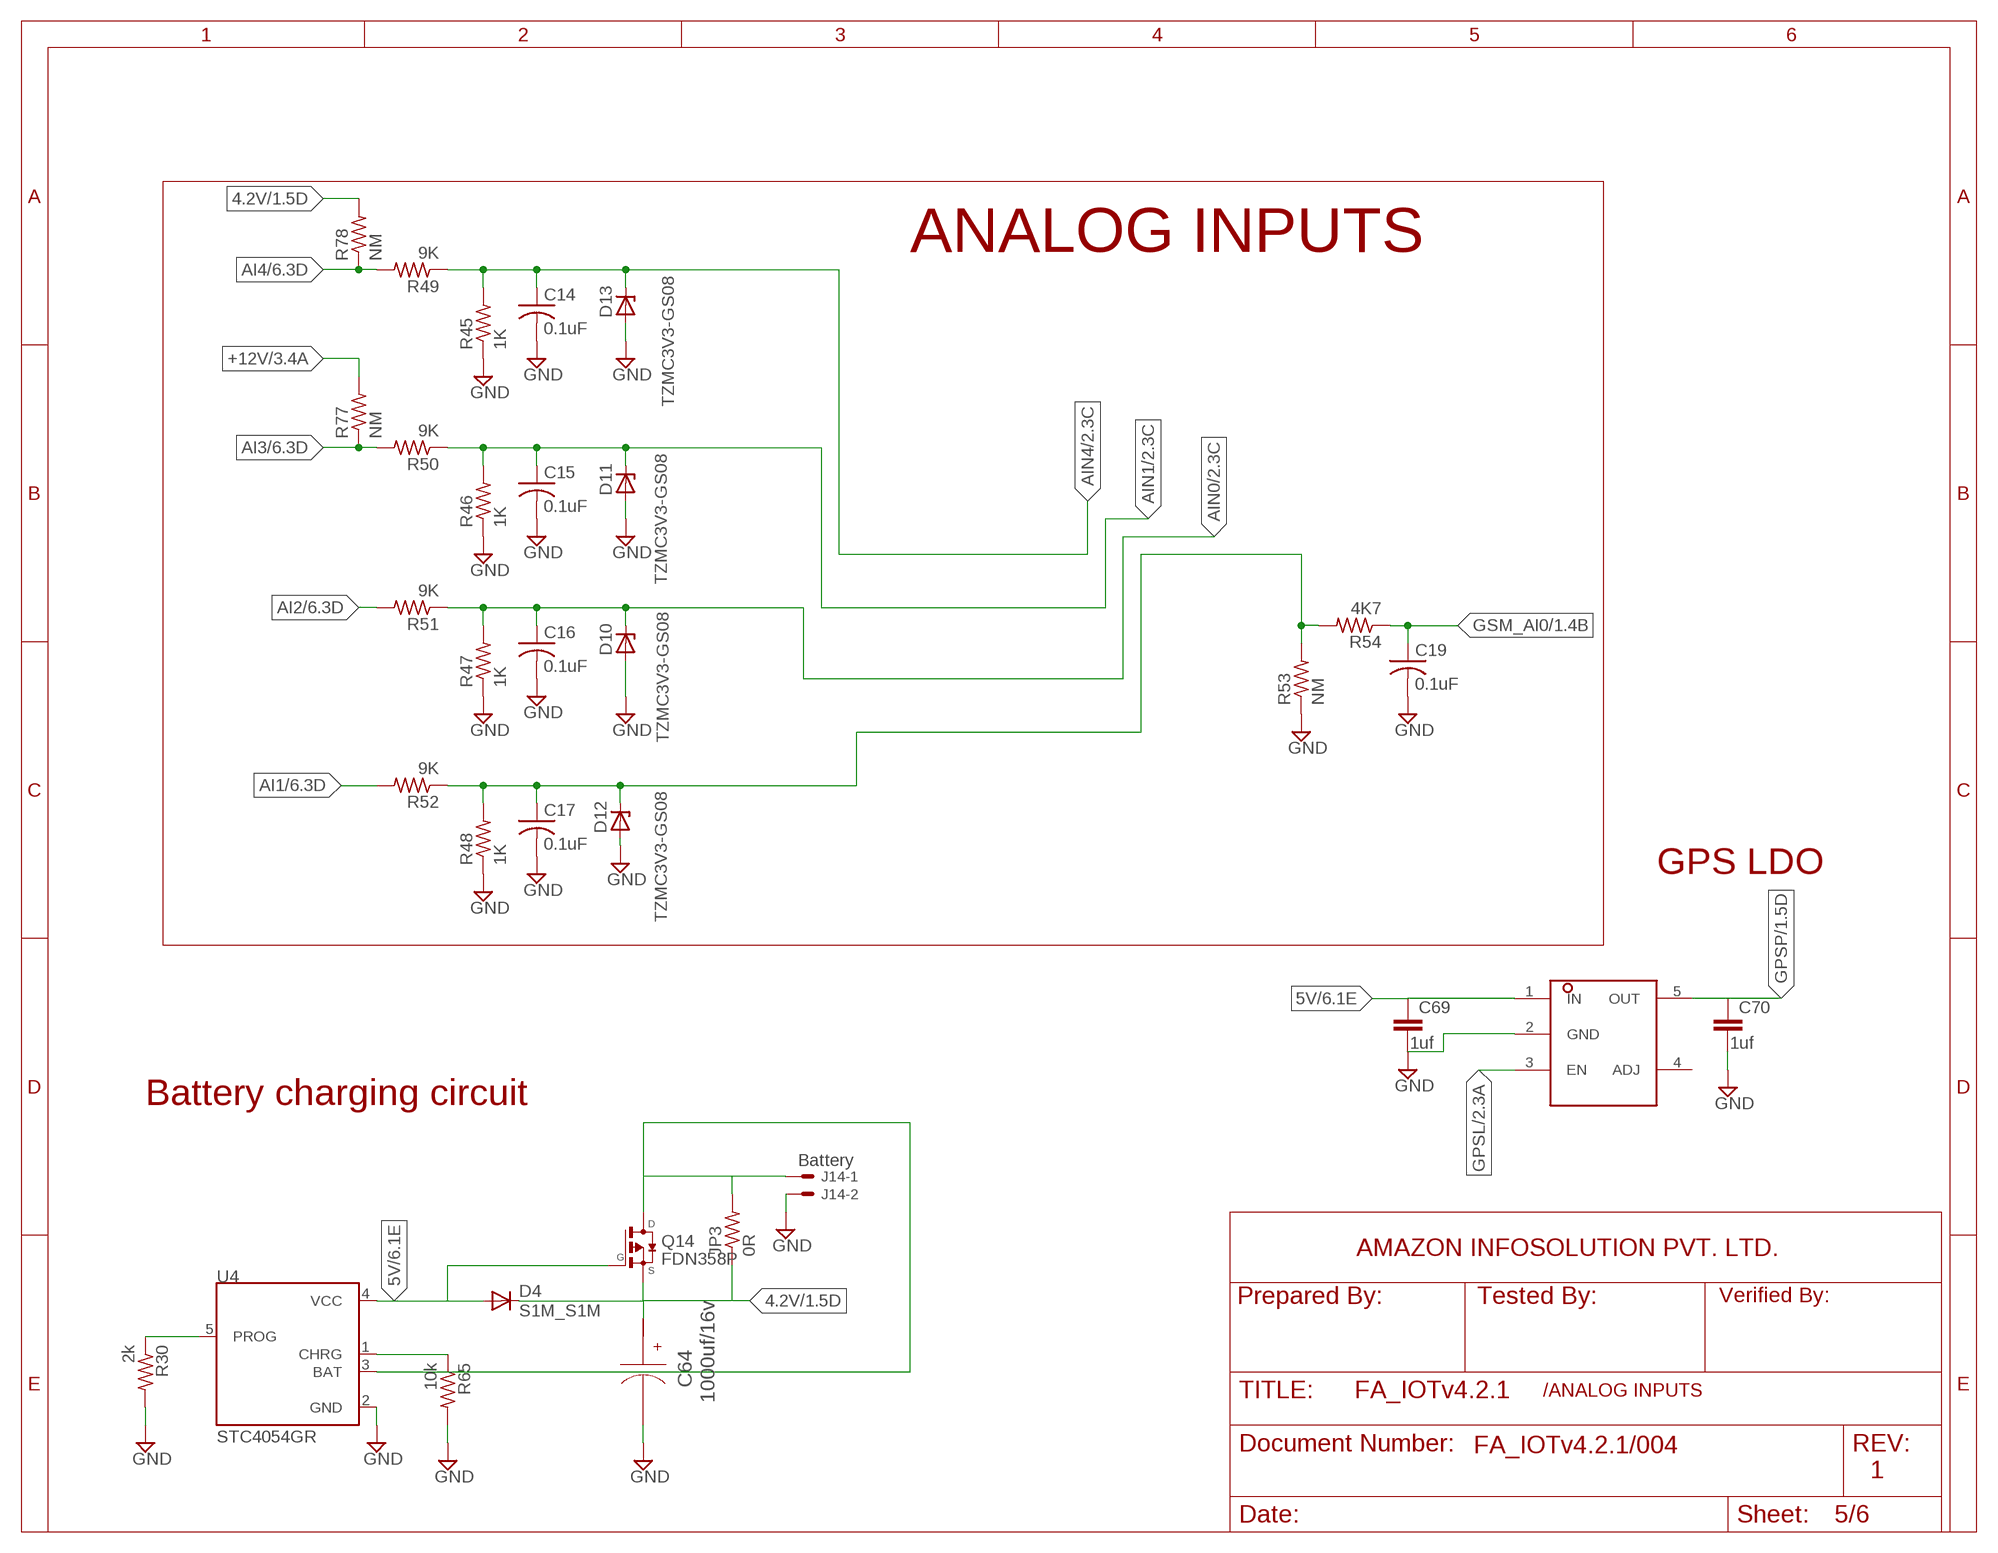
[diagram p4: schematic, sheet 5]

### Parts
C14  0.1uF  C-USC0402  [C0402]
C15  0.1uF  C-USC0402  [C0402]
C16  0.1uF  C-USC0402  [C0402]
C17  0.1uF  C-USC0402  [C0402]
C19  0.1uF  C-USC0402  [C0402]
C64  1000uf/16v  EEV-FK2A470Q  [SM_RADIAL_H13]
C69  1uf  C-EUC0603  [C0603]
C70  1uf  C-EUC0603  [C0603]
D4  S1M_S1M  [S1M_DO-214AC]
D10  TZMC3V3-GS08  ZENER-DIODESOD80C  [SOD80C]
D11  TZMC3V3-GS08  ZENER-DIODESOD80C  [SOD80C]
D12  TZMC3V3-GS08  ZENER-DIODESOD80C  [SOD80C]
D13  TZMC3V3-GS08  ZENER-DIODESOD80C  [SOD80C]
J14  Battery  22-27-2021-02  [6410-02]
JP3  0R  R-US_R0805  [R0805]
Q14  FDN358P  [SSOT-3]
R30  2k  R-US_R0402  [R0402]
R45  1K  R-US_R0402  [R0402]
R46  1K  R-US_R0402  [R0402]
R47  1K  R-US_R0402  [R0402]
R48  1K  R-US_R0402  [R0402]
R49  9K  R-US_R0402  [R0402]
R50  9K  R-US_R0402  [R0402]
R51  9K  R-US_R0402  [R0402]
R52  9K  R-US_R0402  [R0402]
R53  NM  R-US_R0402  [R0402]
R54  4K7  R-US_R0402  [R0402]
R65  10k  R-US_R0402  [R0402]
R77  NM  R-US_R0805  [R0805]
R78  NM  R-US_R0805  [R0805]
U4  STC4054GR  [SOT95P280X110-5N]
U$4  LDK220M33R  [SOT95P280X145-5N]

### Nets
4.2V [POWER]: C64.1(+) D4.C JP3.1 Q14.2(S) R78.2 ; also sheet 1,2,3
5V: C69.1 D4.A Q14.1(G) U4.4(VCC) U$4.1(IN) ; also sheet 1,2,4,6
+12V [POWER]: R77.2 ; also sheet 3,4
AI1: R52.2 ; also sheet 6
AI2: R51.2 ; also sheet 6
AI3: R50.2 R77.1 ; also sheet 6
AI4: R49.2 R78.1 ; also sheet 6
AIN0: C16.1 D10.C R47.2 R51.1 ; also sheet 2
AIN1: C15.1 D11.C R46.2 R50.1 ; also sheet 2
AIN4: C14.1 D13.C R45.2 R49.1 ; also sheet 2
FB4: C17.1 D12.C R48.2 R52.1 R53.2 R54.2
GND: C14.2 C15.2 C16.2 C17.2 C19.2 C64.2(-) C69.2 C70.2 D10.A D11.A D12.A D13.A J14.2 R30.2 R45.1 R46.1 R47.1 R48.1 R53.1 R65.2 U4.2(GND) U$4.2(GND) ; also sheet 1,2,3,4,6
GPSL: U$4.3(EN) ; also sheet 2
GPSP: C70.1 U$4.5(OUT) ; also sheet 1
GSM_AI0: C19.1 R54.1 ; also sheet 1
N$15: J14.1 JP3.2 Q14.3(D) U4.3(BAT)
N$35: R65.1 U4.1(CHRG)
N$45: R30.1 U4.5(PROG)
Unconnected: U$4.4(ADJ)

### Notes on the sheet
- ANALOG INPUTS
- GPS LDO
- Battery charging circuit
- AMAZON INFOSOLUTION PVT. LTD.
- Prepared By: | Tested By: | Verified By:
- /ANALOG INPUTS
- FA_IOTv4.2.1/004
- 1

## Sheet 6 of 6
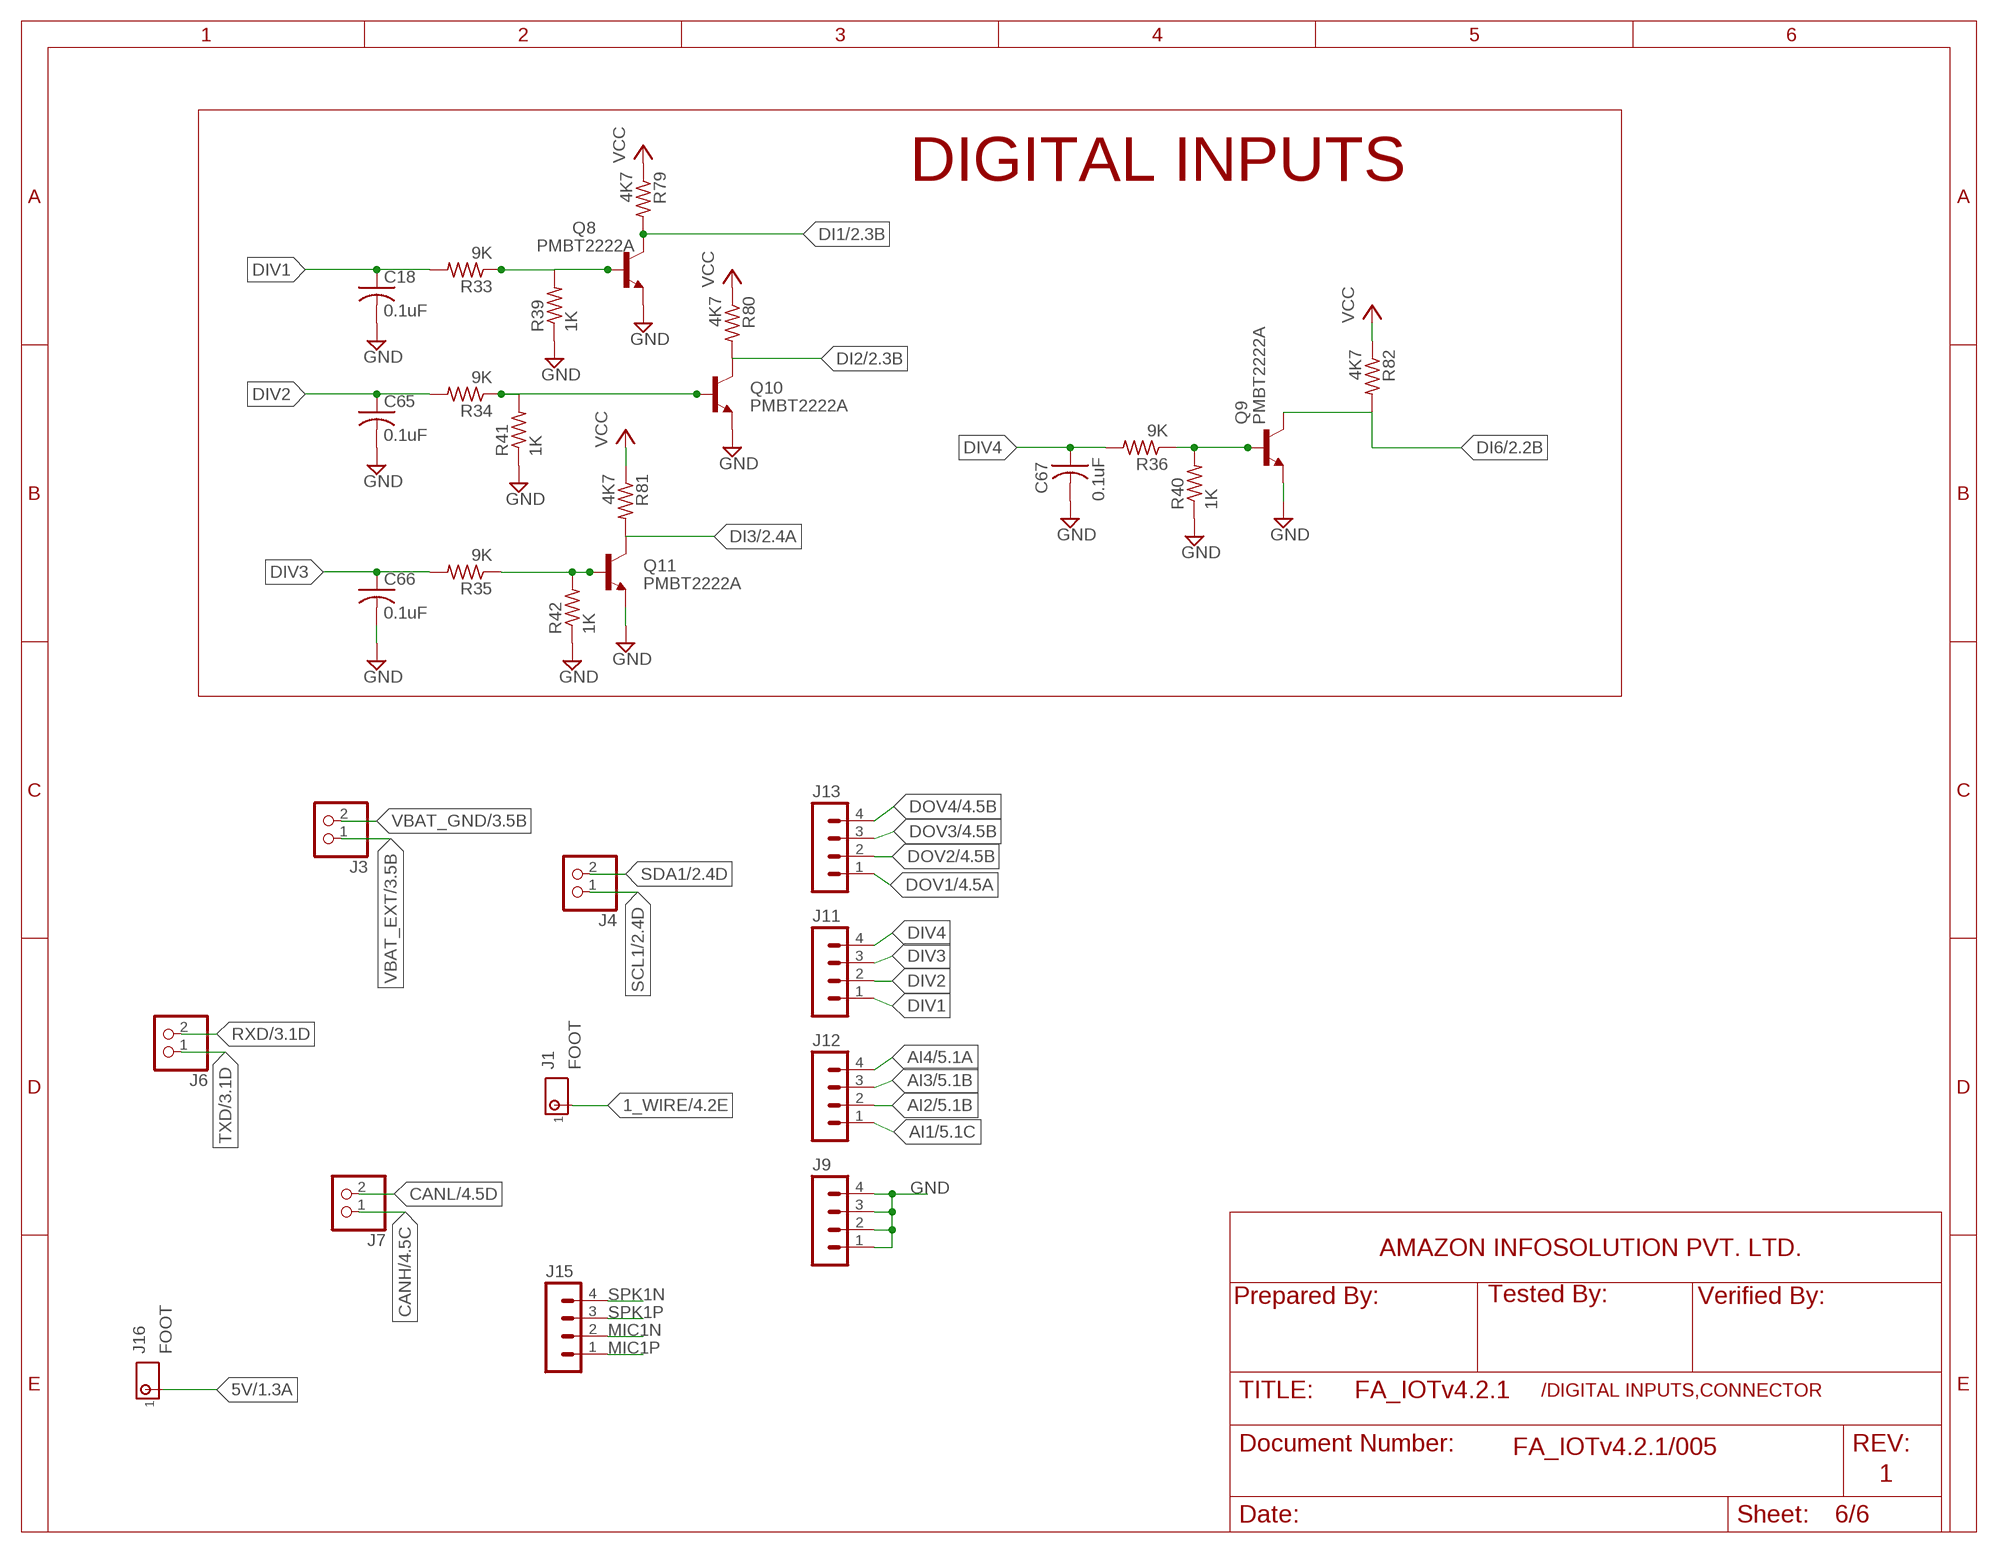
[diagram p5: schematic, sheet 6]

### Parts
C18  0.1uF  C-USC0402  [C0402]
C65  0.1uF  C-USC0402  [C0402]
C66  0.1uF  C-USC0402  [C0402]
C67  0.1uF  C-USC0402  [C0402]
J1  FOOT  [FOOT]
J3  PINHD-1X2  [1X02]
J4  PINHD-1X2  [1X02]
J6  PINHD-1X2  [1X02]
J7  PINHD-1X2  [1X02]
J9  MA04-1  [MA04-1]
J11  MA04-1  [MA04-1]
J12  MA04-1  [MA04-1]
J13  MA04-1  [MA04-1]
J15  MA04-1  [MA04-1]
J16  FOOT  [FOOT]
Q8  PMBT2222A  [SOT23-BEC]
Q9  PMBT2222A  [SOT23-BEC]
Q10  PMBT2222A  [SOT23-BEC]
Q11  PMBT2222A  [SOT23-BEC]
R33  9K  R-US_R0402  [R0402]
R34  9K  R-US_R0402  [R0402]
R35  9K  R-US_R0402  [R0402]
R36  9K  R-US_R0402  [R0402]
R39  1K  R-US_R0402  [R0402]
R40  1K  R-US_R0402  [R0402]
R41  1K  R-US_R0402  [R0402]
R42  1K  R-US_R0402  [R0402]
R79  4K7  R-US_R0402  [R0402]
R80  4K7  R-US_R0402  [R0402]
R81  4K7  R-US_R0402  [R0402]
R82  4K7  R-US_R0402  [R0402]

### Nets
1_WIRE: J1.1 ; also sheet 4
5V: J16.1 ; also sheet 1,2,4,5
AI1: J12.1 ; also sheet 5
AI2: J12.2 ; also sheet 5
AI3: J12.3 ; also sheet 5
AI4: J12.4 ; also sheet 5
CANH: J7.1 ; also sheet 4
CANL: J7.2 ; also sheet 4
DI1: Q8.C R79.2 ; also sheet 2
DI2: Q10.C R80.2 ; also sheet 2
DI3: Q11.C R81.2 ; also sheet 2
DI6: Q9.C R82.2 ; also sheet 2
DIV1: C18.1 J11.1 R33.2
DIV2: C65.1 J11.2 R34.2
DIV3: C66.1 J11.3 R35.2
DIV4: C67.1 J11.4 R36.2
DOV1: J13.1 ; also sheet 4
DOV2: J13.2 ; also sheet 4
DOV3: J13.3 ; also sheet 4
DOV4: J13.4 ; also sheet 4
GND: C18.2 C65.2 C66.2 C67.2 J9.1 J9.2 J9.3 J9.4 Q8.E Q9.E Q10.E Q11.E R39.1 R40.1 R41.1 R42.1 ; also sheet 1,2,3,4,5
MIC1N: J15.2 ; also sheet 1,2
MIC1P: J15.1 ; also sheet 1,2
N$25: Q8.B R33.1 R39.2
N$26: Q9.B R36.1 R40.2
N$27: Q10.B R34.1 R41.2
N$28: Q11.B R35.1 R42.2
RXD: J6.2 ; also sheet 3
SCL1: J4.1 ; also sheet 2,3
SDA1: J4.2 ; also sheet 2,3
SPK1N: J15.4 ; also sheet 1,2
SPK1P: J15.3 ; also sheet 1,2
TXD: J6.1 ; also sheet 3
VBAT_EXT: J3.1 ; also sheet 3
VBAT_GND: J3.2 ; also sheet 3
VCC: R79.1 R80.1 R81.1 R82.1 ; also sheet 1,2,3,4

### Notes on the sheet
- DIGITAL INPUTS
- AMAZON INFOSOLUTION PVT. LTD.
- Prepared By: | Tested By: | Verified By:
- /DIGITAL INPUTS,CONNECTOR
- FA_IOTv4.2.1/005
- 1

## Power pins joined to a net without a drawn wire
GND: U2.23(GND) U2.35(GND) U2.47(GND)
VCC: U2.24(VCC) U2.36(VCC) U2.48(VCC)

## Library data of the parts
C1-C3 C20-C32 C52-C56 C58 = rcl:C-EU: CAPACITOR, European symbol
C4-C12 C14-C19 C41 C45 C57 C59 C60 C62 C63 C65-C67 = rcl:C-US: CAPACITOR, American symbol
C13 C34-C36 C39 C42-C44 C46-C50 C68-C71 = resistor:C-EU: CAPACITOR, European symbol
C33 = WE_Kondensatoren (rev17a) CAP:WCAP-PSLP: WCAP-PSLP Aluminum Polymer Capacitors Characteristics Aluminum Polymer Capacitor Recommended soldering: Reflow Operating temperature: -55 °C to +105 °C Low profile SMD product series Low ESR at high frequency range High permissible ripple current Load life:2000 h @ +105 °C Package name and Variant abbreviation: Package: Package: B X C X A = length of the solder pad X width of the solder pad X pitch of the solder pad. Variant: D X L = Diameter of the body part X Height of the body part. <http://katalog.we-online.de/media/images/eisos/WCAP-PSLP_pf2.jpg> Details see: http://katalog.we-online.de/en/pbs/WCAP-PSLP?m Created: 2015-03-10 2015 (C) Wurth Elektronik; WE-NUMBER: 875105945001/4,7uF
C37 = WE_Kondensatoren (rev17a) CAP:WCAP-ASLI: WCAP-ASLI Aluminum Electrolytic Capacitors Characteristics Aluminum Electrolytic Capacitor Recommended soldering: Reflow Operating temperature: -55 °C to +105 °C Low impedance product series Load life:2000 h @ +105 °C Package name and Variant abbreviation: Package: Package: B X C X A = length of the solder pad X width of the solder pad X pitch of the solder pad. <http://katalog.we-online.de/media/images/eisos/WCAP-ASLI_pf2.jpg> Details see: http://katalog.we-online.de/en/pbs/WCAP-ASLI Updated by: Yingchun,Shan Updated: 2017-03-16 2017 (C) Wurth Elektronik; WE-NUMBER: 865080343005/33uF
C38 C40 = resistor:C-US: CAPACITOR, American symbol
C51 = cap-pan40:C-PR: POLARIZED ELECTROLYTIC/TANTALUM
C61 C64 = EEV-FK2A470Q:EEV-FK2A470Q; AVAILABILITY: Good; DESCRIPTION: Cap Aluminum Lytic 47uF 100V 20% _12.5 X 13.5mm_ SMD 0.32 Ohm 500mA 2000h 105Â°C Automotive T/R; MF: Panasonic; MP: EEV-FK2A470Q; PACKAGE: Radial Panasonic; PRICE: 0.66 USD
D1 = 1N4148WS-7-F:1N4148WS-7-F: 1N4148WS Series 2 A 75 V 200 mW Surface Mount Fast Switching Diode - SOD-323; AVAILABILITY: Good; DESCRIPTION: 1N4148WS Series 2 A 75 V 200 mW Surface Mount Fast Switching Diode - SOD-323; MF: Diodes Inc.; MP: 1N4148WS-7-F; PACKAGE: SOD-323 Diodes Inc.; PRICE: 0.05 USD
D2 D3 D8 D9 D15 D18 = S1M:S1M; AVAILABILITY: Good; DESCRIPTION: S1 Series 1000 V 1 A 1 uA Surface Mount General Purpose Rectifier - DO-214AC; MF: ON Semiconductor; MP: S1M; PACKAGE: DO-214AC-214 ON Semiconductor; PRICE: 0.11 USD
D4 = FF_IOT_4.1:S1M_S1M; AVAILABILITY: Good; DESCRIPTION: S1 Series 1000 V 1 A 1 uA Surface Mount General Purpose Rectifier - DO-214AC; MF: ON Semiconductor; MP: S1M; PACKAGE: DO-214AC-214 ON Semiconductor; PRICE: 0.11 USD
D7 = EMCComponents (rev19c) (1):WE-TVSP_BI_1500W: WE-TVSP Power TVS Diode <http://katalog.we-online.de/media/images/v2/WE-TVSP_600W-3000W_D0214AA_4C.jpg> Details see: http://katalog.we-online.de/en/pbs/WE-TVSP/824500101 2015 (C) Würth Elektronik
D10-D13 D17 D19 = zener SOD80:ZENER-DIODE: Z-Diode
J1 J16 = connector:FOOT
J2 = m-pad-2.1:CON-HIROSE-COAXIAL: Hirose SMT 50 ohm impedance connector W.FL ............................. 1.4mm mated height, ultra small SMT connectors .................................. DC to 3GHz U.FL .............................. 1.9mm or 2.4mm mated height, ultra small SMT connectors ................... DC to 6GHz E.FL ............................... 3.2mm mated height, ultra small SMT connectors .................................. DC to 2GHz H.FL .............................. 3.0mm mated height, ultra small SMT connectors ................................... DC to 3GHz S.FL. ............................. 6.0mm mated height, SMT connectors ................................................... DC to 2.5GHz FL ................................. 10.5mm mated height, SMT connectors .................................................. DC to 1.5GHz Please send any comments to: messi@users.sourceforge.net
J3 J4 J6 J7 = pinhead:PINHD-1X2: PIN HEADER
J5 = SparkFun-Connectors:USB_MINI-B: USB type Mini-B Connector Breaks out 5th pin, and includes shield pins if needed. SparkFun Products: SparkFun FTDI Basic Breakout <https://www.sparkfun.com/products/9716> SparkFun XBee Explorer USB <https://www.sparkfun.com/products/11812> SparkFun Redboard <https://www.sparkfun.com/products/12757>; PROD_ID: CONN-08193; SF_ID: PRT-00587
J8-J13 J15 = con-lstb:MA04-1: PIN HEADER; OC_FARNELL: unknown; OC_NEWARK: unknown
J14 = con-molex:22-?-02: CONNECTOR wire to board 2.54 mm (.1 inch) pitch header; OC_FARNELL: unknown; OC_NEWARK: unknown
JP1-JP4 R1-R11 R14-R24 R26-R68 R72-R84 R86 R87 = resistor:R-US_: RESISTOR, American symbol
L1 = rcl:L-EU: INDUCTOR, European symbol
L2 = WE_PowerMagnetics (rev18c):WE-PD_1260: SMD Shielded Power Inductor Characteristics Magnetically shielded version which results in a low leakage field High Saturation currents up to 25 A Very low self-losses at high switching frequency‘s Wide inductances spectrum available at all sizes Operating temperature: –40 °C to +125 °C Applications Perfectly suitable for switching regulators with extremely high efficiency Integrated DC/DC- converter Switching regulators with low operating voltages (Graphic cards, embedded PC-Cards, Mainboards) Plastic base: Because of the one piece construction these are more suitable for high vibration or shock applications <http://katalog.we-online.de/media/images/v2/Family_WE-PD.jpg> Details see: http://katalog.we-online.de/en/pbs/WE-PD? Updated by Dan Xu 2014-07-08 2014 (C) Wurth Elektronik; WE-NUMBER: 744771115/15uH
LED1-LED3 = led:LED: LED OSRAM: - CHIPLED LG R971, LG N971, LY N971, LG Q971, LY Q971, LO R971, LY R971 LH N974, LH R974 LS Q976, LO Q976, LY Q976 LO Q996 - Hyper CHIPLED LW Q18S LB Q993, LB Q99A, LB R99A - SideLED LS A670, LO A670, LY A670, LG A670, LP A670 LB A673, LV A673, LT A673, LW A673 LH A674 LY A675 LS A676, LA A676, LO A676, LY A676, LW A676 LS A679, LY A679, LG A679 - Hyper Micro SIDELED® LS Y876, LA Y876, LO Y876, LY Y876 LT Y87S - SmartLED LW L88C, LW L88S LB L89C, LB L89S, LG L890 LS L89K, LO L89K, LY L89K LS L896, LA L896, LO L896, LY L896 - TOPLED LS T670, LO T670, LY T670, LG T670, LP T670 LSG T670, LSP T670, LSY T670, LOP T670, LYG T670 LG T671, LOG T671, LSG T671 LB T673, LV T673, LT T673, LW T673 LH T674 LS T676, LA T676, LO T676, LY T676, LB T676, LH T676, LSB T676, LW T676 LB T67C, LV T67C, LT T67C, LS T67K, LO T67K, LY T67K, LW E67C LS E67B, LA E67B, LO E67B, LY E67B, LB E67C, LV E67C, LT E67C LW T67C LS T679, LY T679, LG T679 LS T770, LO T770, LY T770, LG T770, LP T770 LB T773, LV T773, LT T773, LW T773 LH T774 LS E675, LA E675, LY E675, LS T675 LS T776, LA T776, LO T776, LY T776, LB T776 LHGB T686 LT T68C, LB T68C - Hyper Mini TOPLED® LB M676 - Mini TOPLED Santana® LG M470 LS M47K, LO M47K, LY M47K Source: http://www.osram.convergy.de LUXEON: - LUMILED® LXK2-PW12-R00, LXK2-PW12-S00, LXK2-PW14-U00, LXK2-PW14-V00 LXK2-PM12-R00, LXK2-PM12-S00, LXK2-PM14-U00 LXK2-PE12-Q00, LXK2-PE12-R00, LXK2-PE12-S00, LXK2-PE14-T00, LXK2-PE14-U00 LXK2-PB12-K00, LXK2-PB12-L00, LXK2-PB12-M00, LXK2-PB14-N00, LXK2-PB14-P00, LXK2-PB14-Q00 LXK2-PR12-L00, LXK2-PR12-M00, LXK2-PR14-Q00, LXK2-PR14-R00 LXK2-PD12-Q00, LXK2-PD12-R00, LXK2-PD12-S00 LXK2-PH12-R00, LXK2-PH12-S00 LXK2-PL12-P00, LXK2-PL12-Q00, LXK2-PL12-R00 Source: www.luxeon.com KINGBRIGHT: KA-3528ASYC Source: www.kingbright.com
MOV1 = FF_IOT_4.2:TMOV14R275E: TMOV; AVAILABILITY: Unavailable; DESCRIPTION: Varistor Rdl 275vrms 14mm; MF: Littelfuse Inc.; MP: TMOV14R275E; PACKAGE: Disc-14 Littelfuse; PRICE: None
Q1 = special:XTAL/S: CRYSTAL
Q2 Q5 Q12 Q13 = semicon-smd-ipc:NPN-TRANSISTOR_: NPN TRANSISTOR
Q3 Q4 Q6-Q11 = PMBT2222A:PMBT2222A: NPN Transistor; AVAILABILITY: Warning; DESCRIPTION: Transistor NPN PMBT2222A NXP SEMICONDUCTORS RoHS miliampere=600 V=40 SO; MF: NXP Semiconductors; MP: PMBT2222A; PACKAGE: SOT-23-3 NXP Semiconductors; PRICE: 0.04 USD
Q14 = FDN358P:FDN358P: Single P-Channel MOSFET Logic Level, PowerTrench; AVAILABILITY: Unavailable; DESCRIPTION: Single P-Channel Logic Level PowerTrench® MOSFET -30V, -1.5A, 125mΩ; MF: ON Semiconductor; MP: FDN358P; PACKAGE: SC-59 ON Semiconductor; PRICE: None
R12 R13 = SparkFun:RESISTOR: Resistor Basic schematic elements and footprints for 0603, 1206, and PTH resistors.
R25 R69-R71 = rcl:R-US_: RESISTOR, American symbol
SIM1 = FF_IOT_4.0:MFF2_SIM
SIM2 = FF_IOT_4.0:912283001; AVAILABILITY: Good; DESCRIPTION: 2.54mm Pitch ChipSIM Connector with Ejector, 6 Circuits, without Pegs, Yellow Button; MF: Molex; MP: 91228-3001; PACKAGE: None; PRICE: 2.90 USD
SW1 = 5-1437565-0:5-1437565-0: Switch Tactile OFF (ON) Round Button Gull Wing 0.05A 12VDC 1.57N SMD T/R; AVAILABILITY: Good; DESCRIPTION: Switch Tactile OFF _ON_ Round Button Gull Wing 0.05A 12VDC 1.57N SMD T/R; EU_ROHS_COMPLIANCE: Compliant; LINK: http://www.te.com/usa-en/product-5-1437565-0.html; MF: TE Connectivity; MP: 5-1437565-0; PACKAGE: None; PRICE: 0.28 USD
U1 = IC:MCP2551: High-Speed CAN Transceiver http://ww1.microchip.com/downloads/en/devicedoc/21667f.pdf
U2 = micro-stm_v3:STM32F103C*T: ARM 32-bit Cortex™-M3 CPU 72 MHz maximum frequency 16 to 128 Kbytes of Flash memory 6 to 20 kbytes of SRAM 37 GPIOs 2.0 to 3.6 V application supply
U4 = STC4054GR:STC4054GR: STC4054 Series 0.8 A Linear Li-Ion Battery Charger Thermal Regulation -TSOT23-5; AVAILABILITY: Unavailable; DESCRIPTION: STC4054 Series 0.8 A Linear Li-Ion Battery Charger Thermal Regulation -TSOT23-5; MF: STMicroelectronics; MP: STC4054GR; PACKAGE: TSOT-23 STMicroelectronics; PRICE: None
U5 = gprs_transceivers:M66
U6 = FF_IOT_4.2:W25Q32FVZPIG_TR: Serial Flash Memory With Dual, Quad Spi; AVAILABILITY: Unavailable; DESCRIPTION: Ic Flash 32mbit 104mhz 8wson; MF: Winbond; MP: W25Q32FVZPIG TR; PACKAGE: WSON-8 Winbond; PRICE: None
U7 = DRIVER-MAX3232ECDR_SOIC16_:DRIVER-MAX3232ECDR(SOIC16): 310070037; AVAILABILITY: Good; DESCRIPTION: 3-V to 5.5-V Multichannel RS-232 Line Driver/Receiver With +/-15kV IEC ESD Protection 16-SOIC 0 to 70; MF: Texas Instruments; MP: MAX3232ECDR; PACKAGE: SOIC-16 Texas Instruments; PRICE: 1.17 USD
U8 = DS2480B:DS2480B: RS232 to 1-Wire Host Adapter/Line Driver with Load Sensor This device is a onewire host and UART interface in one chip. It provides the complete DC/AC requirements for onewire communication, including overdrive speed mode and 12V EPROM programming. On the UART side, it can operate at 9.6kBaud (default), 19.2kBaud, 57.6kBaud, and 115.2kBaud. The RxD and TxD lines are operated at 0V/5V. The POL pin selects the RxD and TxD "polarity", that means straight-through or inverted. If POL is connected to GND, RxD and TxD behave properly for connection to inverted RS232 drivers, like the MC1488/1489 or MAX23x chips. If POL is connected to Vdd, RxD and TxD behave properly for direct connection to a 0V/5V UART chip. Important Notes: RxD and TxD are seen from the UART point of view, that means the DS2480B TxD pin is really an input and the DS2480B RxD pin is really an output. Vpp must be connected to 5V/Vdd if EPROM programming is not required. Vdd must be always lower than or equal to Vpp, otherwise the chip will be damaged. Best idea is to provide a separate 12V->5V/5mA voltage regulator from Vpp to Vdd if EPROM programming is required. Author: Jan Kandziora <jjj@gmx.de>; AVAILABILITY: Warning; DESCRIPTION: Serial 1-w Line Dr w/Sens 8-Soic<Az; MF: Maxim Integrated; MP: DS2480B; PACKAGE: SOIC-8 Maxim Integrated; PRICE: 3.97 USD
U9 = invensense:MPU6050: The triple-axis MEMS gyroscope
U10 = mp4559dn:MP4559DN: Power DC DC Converter
U11 = DF10S:DF10S: Bridge Rectifiers; AVAILABILITY: Unavailable; DESCRIPTION: DF10S Series 1.5 A 1000 V 5 uA Surface Mount Bridge Rectifier -SDIP-4; MF: ON Semiconductor; MP: DF10S; PACKAGE: SMD-4 ON Semiconductor; PRICE: None
U12 = WE-TVS_82402375:WE-TVS_82402375: TVS Diode Standard Series Characteristics Operating temperature: –55 ºC to +85 °C for 824 023 x; –55 ºC to +125 °C for 824 021/824 022 Very low clamping voltage High ESD withstand voltage Unidirectional or bidirectional protection RoHS, REACH and free of halogens Applications DC power supply Headsets and accessories PDAs Digital cameras MP3-Player Touch Panels ESD protection in accordance with EN 61000-4-2 – 8 kV contact discharge – 15 kV air discharge Updated by Dan Xu 2014-07-11 2014 (C) Wurth Elektronik; AVAILABILITY: Warning; DESCRIPTION: TVS Diode Array WE-TVS 5-Line UniDir. 5V; MF: Wurth Electronics; MP: 82402375; PACKAGE: SC-70 Würth Elektronik; PRICE: 0.63 USD
U$1 = FF_IOT_4.2:L89
U$3 = LD39200PU33R:LD39200PU33R; AVAILABILITY: Unavailable; DESCRIPTION: 2 A high PSRR utra low drop linear regulator with reverse current protection; MF: STMicroelectronics; MP: LD39200PU33R; PACKAGE: DFN-6 STMicroelectronics; PRICE: None
U$4 = LDK220M33R:LDK220M33R

## Net classes
1 POWER: clearance 0.205 mm
2 GND: clearance 0.205 mm
3 CAN: width 0.254 mm, clearance 0.205 mm